# Altium project HU_revC.PrjPcb (part 4 of 4)

## Sheet PWR_SW_AND_VI_SENSE.SchDoc
size B; SheetNumber: 16; SheetTotal: 21
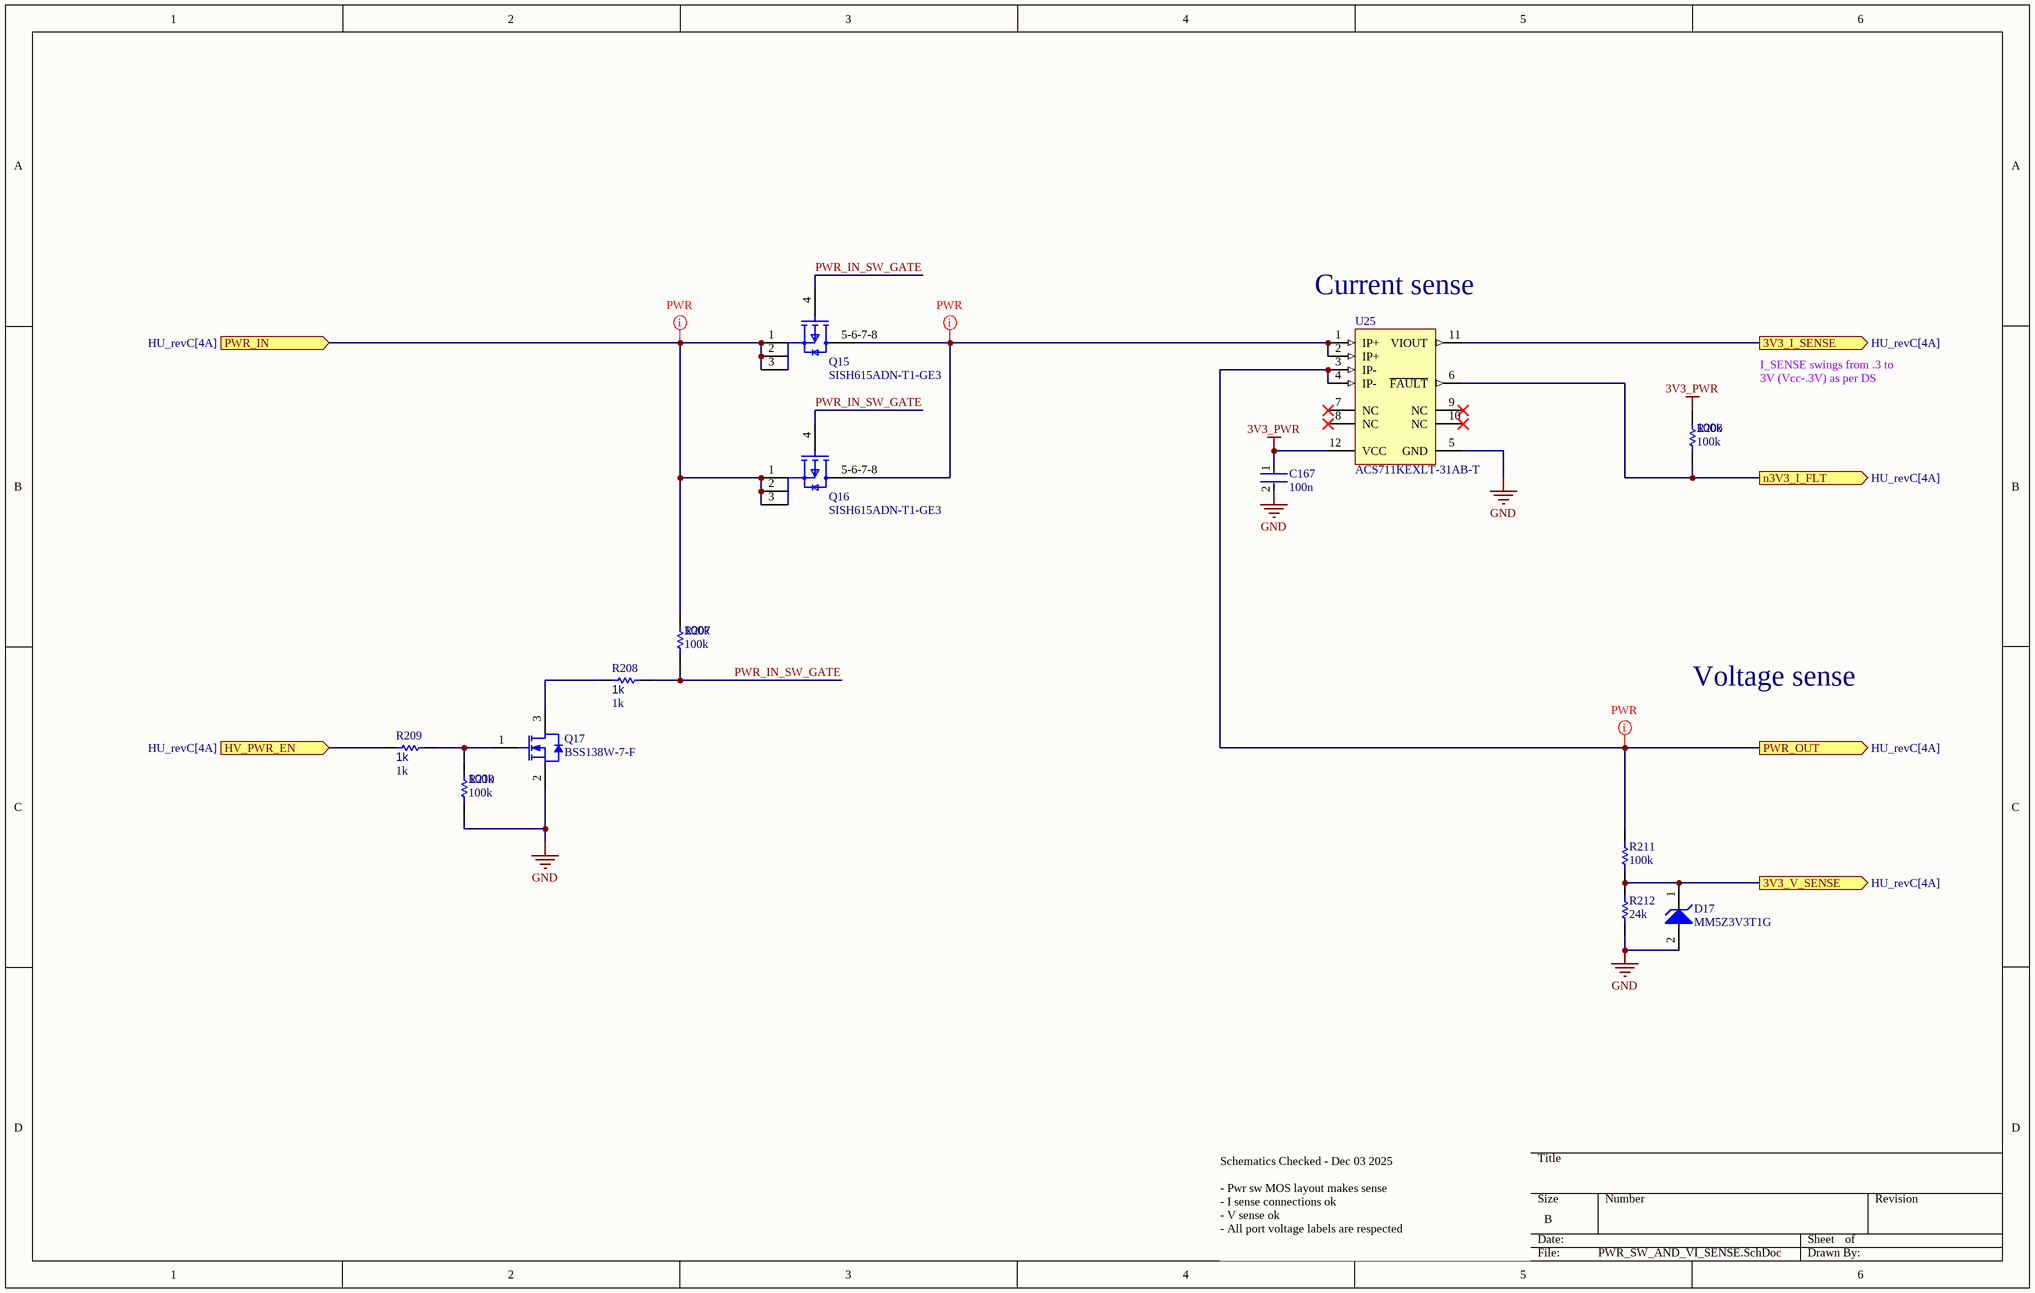
[diagram p24: PWR_SW_AND_VI_SENSE.SchDoc]

### Parts
C167  100n  [FP-0402-L_1_0_0_05-W_0_5-IPC_A]
D17  MM5Z3V3T1G  [ONSC-SOD-523-2-502-01_V]
Q15  SISH615ADN-T1-GE3  [SISH615ADN-T1-GE3-Footprint-1]
Q16  SISH615ADN-T1-GE3  [SISH615ADN-T1-GE3-Footprint-1]
Q17  BSS138W-7-F  [DIOD-SOT323-3_V]
R206  100k  [R0603B]
R207  100k  [R0603B]
R208  1k  [R0603B]
R209  1k  [R0603B]
R210  100k  [R0603B]
R211  100k  [R0603B]
R212  24k  [R0603B]
U25  ACS711KEXLT-31AB-T  [ALEG-EX-12_V]

### Ports
3V3_I_SENSE (out, see HU_revC[4A]), 3V3_V_SENSE (out, see HU_revC[4A]), HV_PWR_EN (in, see HU_revC[4A]), n3V3_I_FLT (out, see HU_revC[4A]), PWR_IN (in, see HU_revC[4A]), PWR_OUT (out, see HU_revC[4A])

### Nets
3V3_PWR: C167.1 R206.2 U25.12(VCC)
GND: C167.2 D17.2(A) Q17.2(S) R210.1 R212.1 U25.5(GND)
INT_VCC: R211.2 U25.3(IP-) U25.4(IP-) ; port PWR_OUT
PRE_VCC: Q15.1(S) Q15.2(S) Q15.3(S) Q16.1(S) Q16.2(S) Q16.3(S) R207.2 ; port PWR_IN
3V3_INPUT_I_SENSE: U25.11(VIOUT) ; port 3V3_I_SENSE
3V3_INPUT_V_SENSE: D17.1(K) R211.1 R212.2 ; port 3V3_V_SENSE
3V3_PWR_nFLT: R206.1 U25.6(~{FAULT}) ; port n3V3_I_FLT
HV_PWR_EN: R209.1 ; port HV_PWR_EN
PWR_IN_SW_GATE: Q15.4(G) Q16.4(G) R207.1 R208.2
NetQ15_5-6-7-8: Q15.5-6-7-8(D) Q16.5-6-7-8(D) U25.1(IP+) U25.2(IP+)
NetQ17_1: Q17.1(G) R209.2 R210.2
NetQ17_3: Q17.3(D) R208.1

Not connected (* = marked no-connect by the designer): U25 7(NC)* 8(NC)* 9(NC)* 10(NC)*

### Layout directives
net class PWR: INT_VCC, NetQ15_5-6-7-8, PRE_VCC

### Notes on the sheet
- (near U25) Current sense
- I_SENSE swings from .3 to 3V (Vcc-.3V) as per DS
- Voltage sense
- Schematics Checked - Dec 03 2025
  - Pwr sw MOS layout makes sense
  - I sense connections ok
  - V sense ok
  - All port voltage labels are respected

### Library data of the parts
C167 = CMP-001-00058-1: as C65 on sheet MAX96724_PINOUT; Min Operating Temperature: -55°C; Mounting Technology: Surface Mount; Pins: 2; Case/Package: 0402; RoHS Compliant: Yes; Max Operating Temperature: 85°C
D17 = CMP-1060-00750-1: Zener Voltage Regulator, 500 mW, 2-Pin SOD-523, Pb-Free, Tape and Reel; Manufacturer: On Semiconductor; P Max (W): 0.5; VZ Typ (V): 3.3; RoHS: Pb-Free; ComponentLink2Description: Datasheet; PackageReference: SOD-523-2-502-01; DatasheetVersion: Rev. 10; ComponentLink1Description: Manufacturer URL; PackageVersion: Rev. E, 09/2010; ComponentLink3URL: http://www.onsemi.com/pub_link/Collateral/502-01.PDF; ComponentLink2URL: http://www.onsemi.cn/pub_link/Collateral/MM5Z2V4T1-D.PDF; Mounting Technology: Surface Mount; PartNumber: MM5Z3V3T1G; Packing: Tape and Reel; PackageDescription: 2-Pin SOD, Body 1.2 x 0.8 mm; ComponentLink1URL: http://www.onsemi.com/; ComponentLink3Description: Package Specification
Q15 Q16 = CMP-013-00018-2: Trans MOSFET P-CH 20V 22.1A 8-Pin PowerPAK 1212 EP T/R; Source: SISH615ADN-T1-GE3.SchLib; Design Item ID: CMP-013-00036-4; Component Type: Standard; Pins: 5
Q17 = CMP-2000-05968-1: N-Channel Enhancement Mode Mosfet, 50 V, 200 mA, -55 to 150 degC, 6-Pin SOT-323, RoHS, Tape and Reel; Typical Turn-Off Delay Time: 20ns; Number of Channels: 1Channel; Type: EnhancementModeFieldEffectTransistor; Brand: DiodesIncorporated; Vds - Drain-Source Breakdown Voltage: 75V; Vgs - Gate-Source Voltage: 20V; Rds On - Drain-Source Resistance: 1.4Ohms; Transistor Type: 1N-Channel; Configuration: Single; Unit Weight: 0.000212oz; Pd - Power Dissipation: 200mW; Id - Continuous Drain Current: 200mA; Forward Transconductance - Min: 0.1S; Manufacturer URL: http://www.diodes.com/; Series: BSS138; Package Description: 3-Pin Small Outline Transistor, Body 2 x 1.25 mm, Pitch 0.65 mm; Mounting Technology: SurfaceMount; Product Category: MOSFET; RoHS: True; Maximum Operating Temperature: +150C; Height: 1mm; Length: 2.2mm; Technology: Si; Width: 1.35mm; Datasheet URL: http://www.diodes.com/_files/datasheets/ds30206.pdf; Manufacturer: DiodesIncorporated; Package / Case: SOT-323-3; Typical Turn-On Delay Time: 20ns; Transistor Polarity: N-Channel; Factory Pack Quantity: 3000; Packaging: Reel; Product: MOSFETSmallSignal; Datasheet Version: Rev. 11-2, 09/2013; Package Reference: SOT323; Minimum Operating Temperature: -55C; Mounting Style: SMD/SMT; Channel Mode: Enhancement
R206-R212 = CMP-009-00002-14: Resistor
  R206 R207 R210 R211: Value: 100k
  R208 R209: Value: 1k
  R212: Value: 24k
U25 = CMP-1557-00002-1: Hall Effect Linear Current Sensor with Overcurrent Fault Output for <100 V Isolation Applications, 3 to 5.5 V, -31 to 31 A IP, -40 to 125 degC, 12-Pin QFN (EX), RoHS, Tape and Reel; IP Max: 31 A; VCC Min: 3 V; -3dB Bandwidth: 0.1 MHz; VCC Max: 5.5 V; IP Min: -31 A; Mounting Technology: Surface Mount; DatasheetVersion: Rev. 3; Temperature Min: -40 degC; ComponentLink1Description: Manufacturer URL; Packing: Tape and Reel; PartNumber: ACS711KEXLT-31AB-T; Temperature Max: 125 degC; ComponentLink2Description: Datasheet; ComponentLink3Description: Package Specification; RoHS: TRUE; ComponentLink1URL: http://www.allegromicro.com/; ComponentLink2URL: http://www.allegromicro.com/~/media/Files/Datasheets/ACS711-Datasheet.ashx?la=en; PackageDescription: 12-Pin Quad Flat No-Lead, Body 3 x 3 mm, Height 0.8 mm; ComponentLink3URL: http://www.allegromicro.com/~/media/Files/Datasheets/ACS711-Datasheet.ashx?la=en

## Sheet FUSE_AND_I_SENSE.SchDoc
size A; SheetNumber: 17; SheetTotal: 21
Used 3 times, as channels PWR_PROT_0, PWR_PROT_1, PWR_PROT_2. Parts and nets are listed once, with the designators drawn on the sheet.
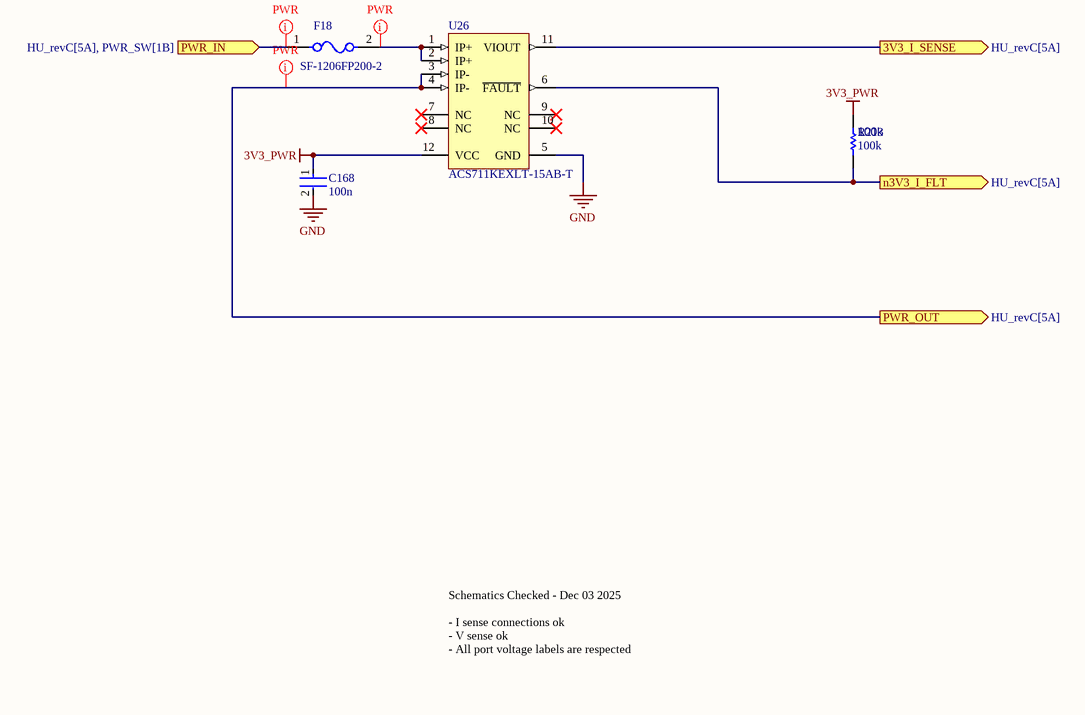
[diagram p25: FUSE_AND_I_SENSE.SchDoc]

### Parts
C168  100n  [FP-0402-L_1_0_0_05-W_0_5-IPC_A]
F18  SF-1206FP200-2  [FP-SF-1206FP-MFG]
R213  100k  [R0603B]
U26  ACS711KEXLT-15AB-T  [ALEG-EX-12_V]

### Ports
3V3_I_SENSE (out, see HU_revC[5A]), n3V3_I_FLT (out, see HU_revC[5A]), PWR_IN (in, see HU_revC[5A], PWR_SW[1B]), PWR_OUT (out, see HU_revC[5A])

### Nets
3V3_PWR: C168.1 R213.2 U26.12(VCC)
GND: C168.2 U26.5(GND)
3V3_I_SENSE: U26.11(VIOUT) ; port 3V3_I_SENSE
n3V3_I_FLT: R213.1 U26.6(~{FAULT}) ; port n3V3_I_FLT
PWR_IN: F18.1 ; port PWR_IN
PWR_OUT: U26.3(IP-) U26.4(IP-) ; port PWR_OUT
NetF18_2: F18.2 U26.1(IP+) U26.2(IP+)

Not connected (* = marked no-connect by the designer): U26 7(NC)* 8(NC)* 9(NC)* 10(NC)*

### Channels
PWR_PROT_0: designators end in _PWR_PROT_0; ports 3V3_I_SENSE=3V3_12V_VCC_I_SENSE n3V3_I_FLT=3V3_PWR_nFLT PWR_IN=INT_VCC PWR_OUT=12V0_PoC
PWR_PROT_1: designators end in _PWR_PROT_1; ports 3V3_I_SENSE=3V3_5V0_VCC_I_SENSE n3V3_I_FLT=3V3_PWR_nFLT PWR_IN=INT_VCC PWR_OUT=NetC27_1
PWR_PROT_2: designators end in _PWR_PROT_2; ports 3V3_I_SENSE=3V3_3V3_VCC_I_SENSE n3V3_I_FLT=3V3_PWR_nFLT PWR_IN=INT_VCC PWR_OUT=NetC57_1

### Layout directives
net class PWR: 12V0_PoC, INT_VCC, NetF18_PWR_PROT_0_2

### Notes on the sheet
- Schematics Checked - Dec 03 2025
  - I sense connections ok
  - V sense ok
  - All port voltage labels are respected

### Library data of the parts
C168 = CMP-001-00058-1: as C65 on sheet MAX96724_PINOUT; Min Operating Temperature: -55°C; Mounting Technology: Surface Mount; Pins: 2; Case/Package: 0402; RoHS Compliant: Yes; Max Operating Temperature: 85°C
F18 = CMP-07399-000013-1: FUSE BOARD MOUNT 2A 63VDC 1206; Voltage Rating (DC): 63V; Fuse Type: Board Mount (Cartridge Style Excluded); Approvals: UL; Mount: Surface Mount; Min Operating Temperature: -20°C; Max Operating Temperature: 105°C; Case Code (Imperial): 1206; Packaging: Cut Tape; Current Rating: 2A; RoHS Compliant: Yes; Series: SinglFuse™ SF-1206FP; Case Code (Metric): 3216; Case/Package: 1206
R213 = CMP-009-00002-14: Resistor; Value: 100k
U26 = CMP-1557-00001-1: Hall Effect Linear Current Sensor with Overcurrent Fault Output for <100 V Isolation Applications, 3 to 5.5 V, -15.5 to 15.5 A IP, -40 to 125 degC, 12-Pin QFN (EX), RoHS, Tape and Reel; VCC Max: 5.5 V; IP Max: 15.5 A; VCC Min: 3 V; IP Min: -15.5 A; -3dB Bandwidth: 0.1 MHz; PackageDescription: 12-Pin Quad Flat No-Lead, Body 3 x 3 mm, Height 0.8 mm; ComponentLink1URL: http://www.allegromicro.com/; Packing: Tape and Reel; ComponentLink2URL: http://www.allegromicro.com/~/media/Files/Datasheets/ACS711-Datasheet.ashx?la=en; DatasheetVersion: Rev. 3; PartNumber: ACS711KEXLT-15AB-T; ComponentLink2Description: Datasheet; ComponentLink3URL: http://www.allegromicro.com/~/media/Files/Datasheets/ACS711-Datasheet.ashx?la=en; RoHS: TRUE; ComponentLink1Description: Manufacturer URL; ComponentLink3Description: Package Specification; Temperature Max: 125 degC; Mounting Technology: Surface Mount; Temperature Min: -40 degC

## Sheet LAN8830_PINOUT.SchDoc
size C; SheetNumber: 18; SheetTotal: 21
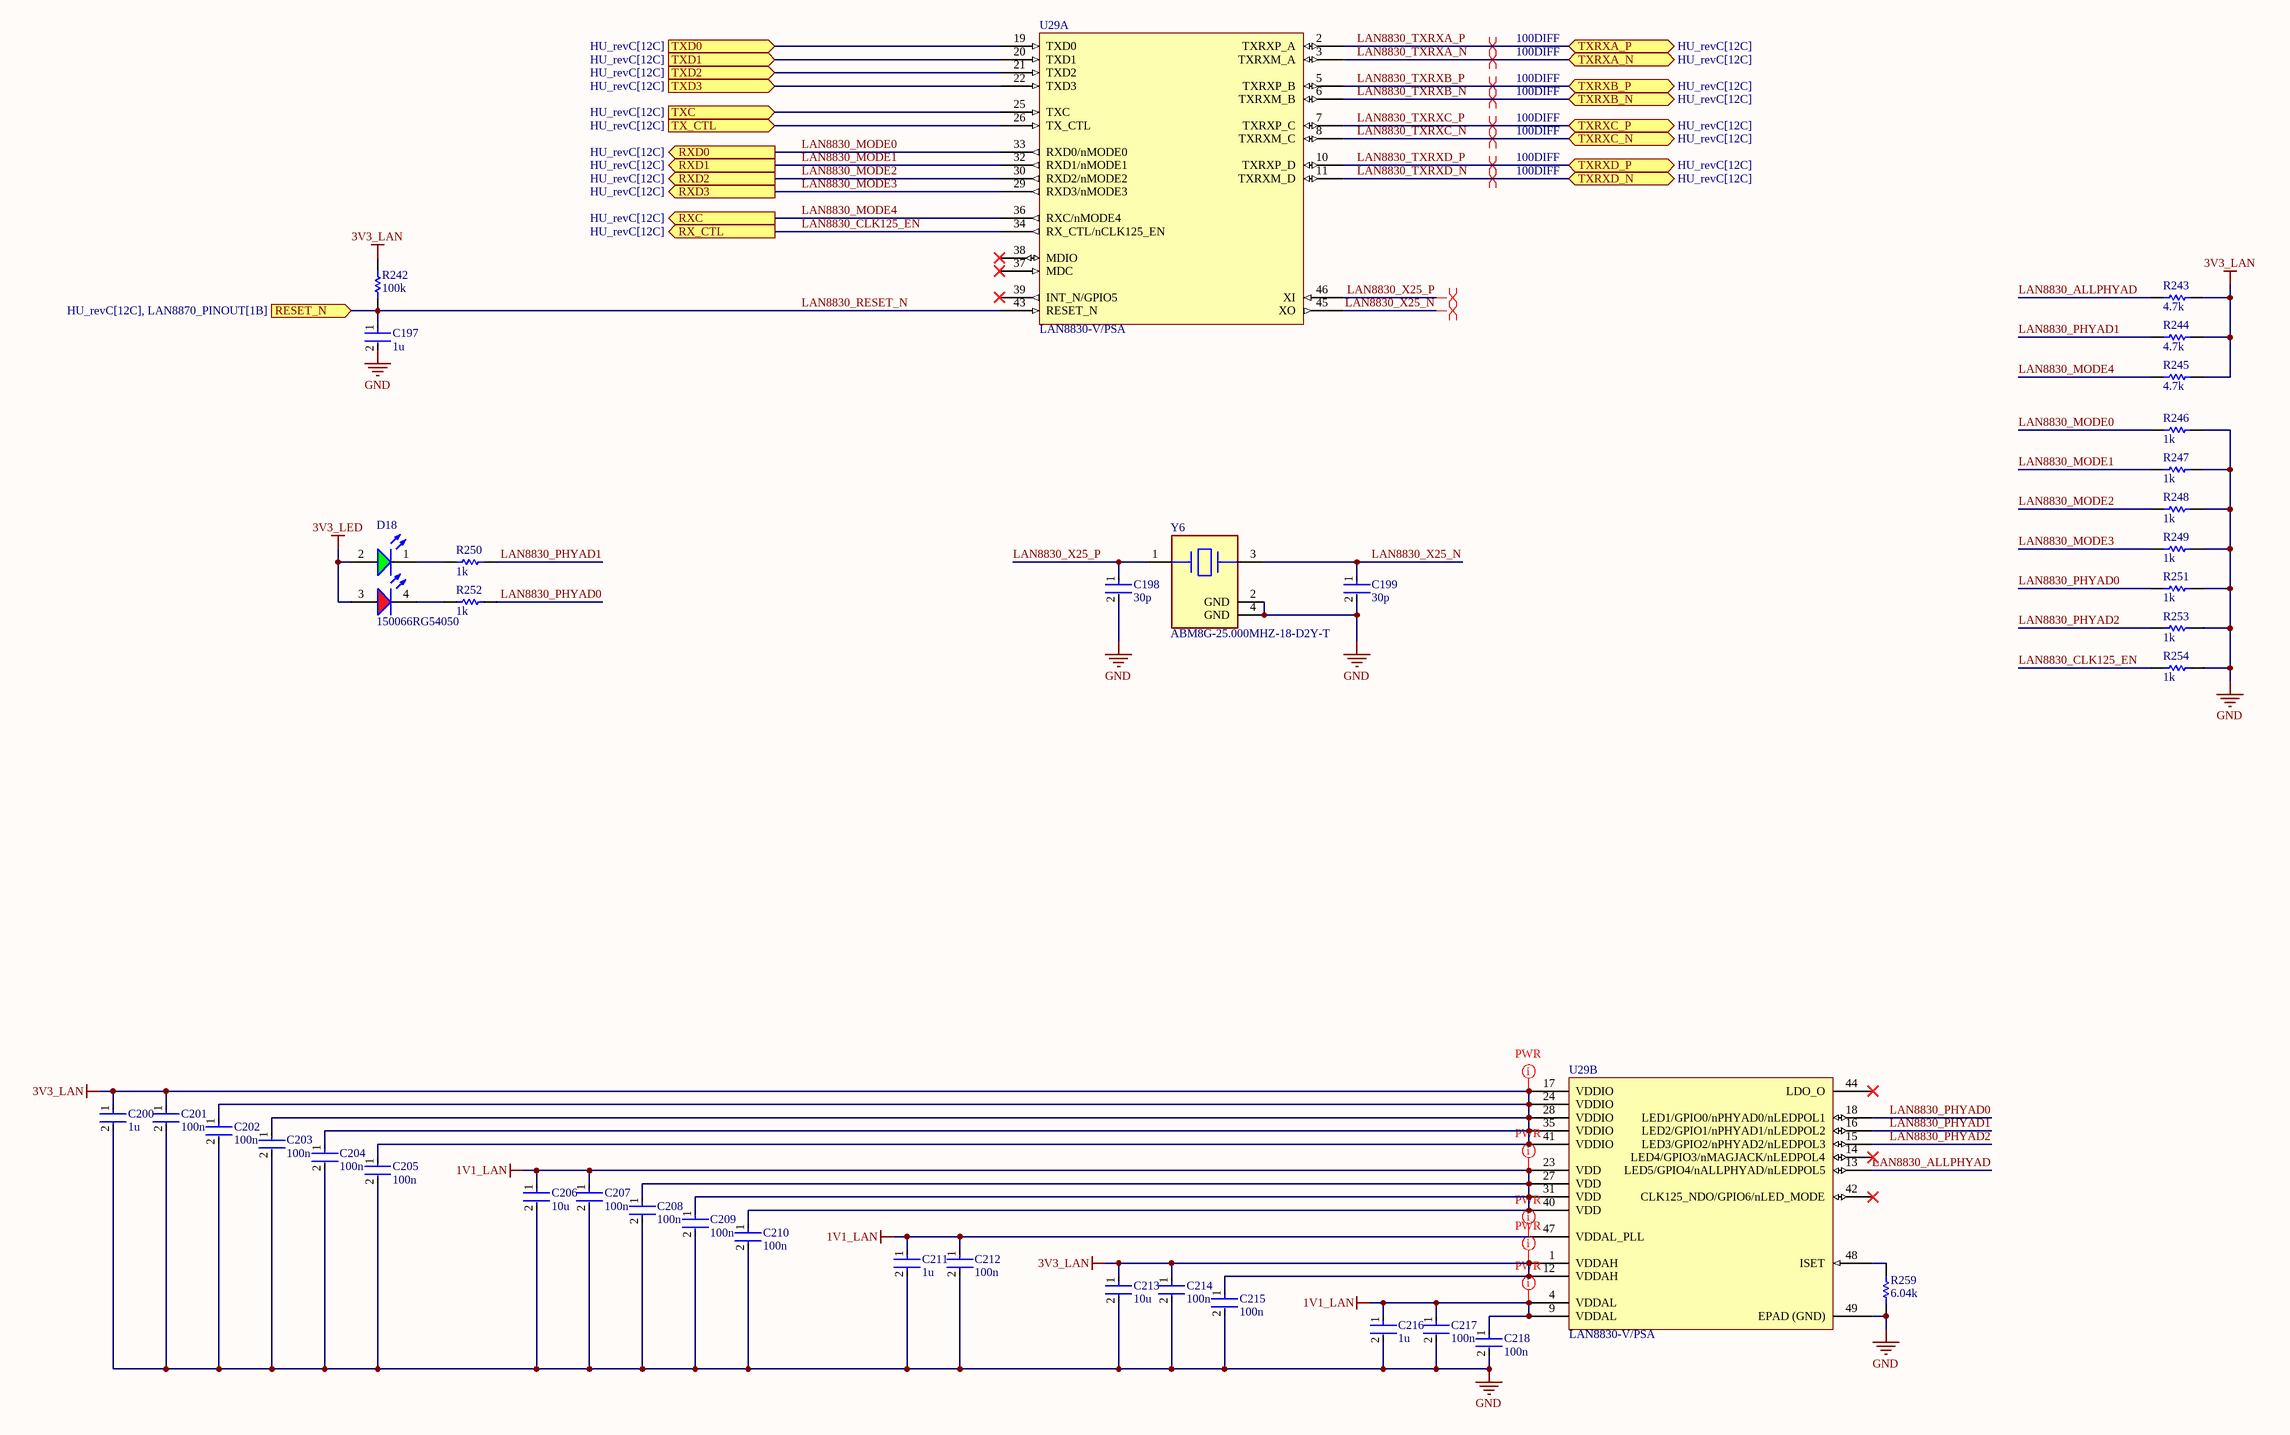
[diagram p26: LAN8830_PINOUT.SchDoc]

### Parts
C197  1u  [FP-0402-L_1_0_0_05-W_0_5-IPC_A]
C198  30p  [FP-0402-L_1_0_0_05-W_0_5-IPC_A]
C199  30p  [FP-0402-L_1_0_0_05-W_0_5-IPC_A]
C200  1u  [FP-0402-L_1_0_0_05-W_0_5-IPC_A]
C201  100n  [FP-0402-L_1_0_0_05-W_0_5-IPC_A]
C202  100n  [FP-0402-L_1_0_0_05-W_0_5-IPC_A]
C203  100n  [FP-0402-L_1_0_0_05-W_0_5-IPC_A]
C204  100n  [FP-0402-L_1_0_0_05-W_0_5-IPC_A]
C205  100n  [FP-0402-L_1_0_0_05-W_0_5-IPC_A]
C206  10u  [FP-0402-L_1_0_0_05-W_0_5-IPC_A]
C207  100n  [FP-0402-L_1_0_0_05-W_0_5-IPC_A]
C208  100n  [FP-0402-L_1_0_0_05-W_0_5-IPC_A]
C209  100n  [FP-0402-L_1_0_0_05-W_0_5-IPC_A]
C210  100n  [FP-0402-L_1_0_0_05-W_0_5-IPC_A]
C211  1u  [FP-0402-L_1_0_0_05-W_0_5-IPC_A]
C212  100n  [FP-0402-L_1_0_0_05-W_0_5-IPC_A]
C213  10u  [FP-0402-L_1_0_0_05-W_0_5-IPC_A]
C214  100n  [FP-0402-L_1_0_0_05-W_0_5-IPC_A]
C215  100n  [FP-0402-L_1_0_0_05-W_0_5-IPC_A]
C216  1u  [FP-0402-L_1_0_0_05-W_0_5-IPC_A]
C217  100n  [FP-0402-L_1_0_0_05-W_0_5-IPC_A]
C218  100n  [FP-0402-L_1_0_0_05-W_0_5-IPC_A]
D18  150066RG54050  [WL-SBCD_0606]
R242  100k  [R0603B]
R243  4.7k  [R0603B]
R244  4.7k  [R0603B]
R245  4.7k  [R0603B]
R246  1k  [R0603B]
R247  1k  [R0603B]
R248  1k  [R0603B]
R249  1k  [R0603B]
R250  1k  [R0603B]
R251  1k  [R0603B]
R252  1k  [R0603B]
R253  1k  [R0603B]
R254  1k  [R0603B]
R259  6.04k  [R0603B]
U29  LAN8830-V/PSA  [QFN50P700X700X100_HS-49N]  (parts A,B of 2)
Y6  ABM8G-25.000MHZ-18-D2Y-T  [FP-ABM8G-MFG]

### Ports
RESET_N (in, see HU_revC[12C], LAN8870_PINOUT[1B]), RX_CTL (out, see HU_revC[12C]), RXC (out, see HU_revC[12C]), RXD0 (out, see HU_revC[12C]), RXD1 (out, see HU_revC[12C]), RXD2 (out, see HU_revC[12C]), RXD3 (out, see HU_revC[12C]), TX_CTL (in, see HU_revC[12C]), TXC (in, see HU_revC[12C]), TXD0 (in, see HU_revC[12C]), TXD1 (in, see HU_revC[12C]), TXD2 (in, see HU_revC[12C]), TXD3 (in, see HU_revC[12C]), TXRXA_N (bidir, see HU_revC[12C]), TXRXA_P (bidir, see HU_revC[12C]), TXRXB_N (bidir, see HU_revC[12C]), TXRXB_P (bidir, see HU_revC[12C]), TXRXC_N (bidir, see HU_revC[12C]), TXRXC_P (bidir, see HU_revC[12C]), TXRXD_N (bidir, see HU_revC[12C]), TXRXD_P (bidir, see HU_revC[12C])

### Nets
1V1_LAN: C206.1 C207.1 C208.1 C209.1 C210.1 C211.1 C212.1 C216.1 C217.1 C218.1 U29.4(VDDAL) U29.9(VDDAL) U29.23(VDD) U29.27(VDD) U29.31(VDD) U29.40(VDD) U29.47(VDDAL_PLL)
3V3_LAN: C200.1 C201.1 C202.1 C203.1 C204.1 C205.1 C213.1 C214.1 C215.1 R242.1 R243.1 R244.1 R245.1 U29.1(VDDAH) U29.12(VDDAH) U29.17(VDDIO) U29.24(VDDIO) U29.28(VDDIO) U29.35(VDDIO) U29.41(VDDIO)
3V3_LED: D18.2(A) D18.3(A)
GND: C197.2 C198.2 C199.2 C200.2 C201.2 C202.2 C203.2 C204.2 C205.2 C206.2 C207.2 C208.2 C209.2 C210.2 C211.2 C212.2 C213.2 C214.2 C215.2 C216.2 C217.2 C218.2 R246.1 R247.1 R248.1 R249.1 R251.1 R253.1 R254.1 R259.2 U29.49(EPAD_(GND)) Y6.2(GND) Y6.4(GND)
LAN8830_ALLPHYAD: R243.2 U29.13(LED5/GPIO4/nALLPHYAD/nLEDPOL5)
LAN8830_CLK125_EN: R254.2 U29.34(RX_CTL/nCLK125_EN) ; port RX_CTL
LAN8830_MODE0: R246.2 U29.33(RXD0/nMODE0) ; port RXD0
LAN8830_MODE1: R247.2 U29.32(RXD1/nMODE1) ; port RXD1
LAN8830_MODE2: R248.2 U29.30(RXD2/nMODE2) ; port RXD2
LAN8830_MODE3: R249.2 U29.29(RXD3/nMODE3) ; port RXD3
LAN8830_MODE4: R245.2 U29.36(RXC/nMODE4) ; port RXC
LAN8830_PHYAD0: R251.2 R252.2 U29.18(LED1/GPIO0/nPHYAD0/nLEDPOL1)
LAN8830_PHYAD1: R244.2 R250.2 U29.16(LED2/GPIO1/nPHYAD1/nLEDPOL2)
LAN8830_PHYAD2: R253.2 U29.15(LED3/GPIO2/nPHYAD2/nLEDPOL3)
LAN8830_RESET_N: C197.1 R242.2 U29.43(RESET_N) ; port RESET_N
LAN8830_TXRXA_N: U29.3(TXRXM_A) ; port TXRXA_N  [project net ETH_TRD0_N]
LAN8830_TXRXA_P: U29.2(TXRXP_A) ; port TXRXA_P  [project net ETH_TRD0_P]
LAN8830_TXRXB_N: U29.6(TXRXM_B) ; port TXRXB_N  [project net ETH_TRD1_N]
LAN8830_TXRXB_P: U29.5(TXRXP_B) ; port TXRXB_P  [project net ETH_TRD1_P]
LAN8830_TXRXC_N: U29.8(TXRXM_C) ; port TXRXC_N  [project net ETH_TRD2_N]
LAN8830_TXRXC_P: U29.7(TXRXP_C) ; port TXRXC_P  [project net ETH_TRD2_P]
LAN8830_TXRXD_N: U29.11(TXRXM_D) ; port TXRXD_N  [project net ETH_TRD3_N]
LAN8830_TXRXD_P: U29.10(TXRXP_D) ; port TXRXD_P  [project net ETH_TRD3_P]
LAN8830_X25_N: C199.1 U29.45(XO) Y6.3
LAN8830_X25_P: C198.1 U29.46(XI) Y6.1
NetD18_1: D18.1(K) R250.1
NetD18_4: D18.4(K) R252.1
NetR52_2: U29.19(TXD0) ; port TXD0
NetR53_2: U29.20(TXD1) ; port TXD1
NetR54_2: U29.21(TXD2) ; port TXD2
NetR55_2: U29.22(TXD3) ; port TXD3
NetR259_1: R259.1 U29.48(ISET)
NetR269_2: U29.25(TXC) ; port TXC
NetR270_2: U29.26(TX_CTL) ; port TX_CTL

Not connected (* = marked no-connect by the designer): U29 14(LED4/GPIO3/nMAGJACK/nLEDPOL4)* 37(MDC)* 38(MDIO)* 39(INT_N/GPIO5)* 42(CLK125_NDO/GPIO6/nLED_MODE)* 44(LDO_O)*

### Layout directives
differential pair; differential pair class 100DIFF: ETH_TRD0_N, ETH_TRD0_P, ETH_TRD1_N, ETH_TRD1_P, ETH_TRD2_N, ETH_TRD2_P, ETH_TRD3_N, ETH_TRD3_P
differential pair: LAN8830_X25_N, LAN8830_X25_P
net class PWR: 1V1_LAN, 3V3_LAN

### Library data of the parts
C197-C218 = CMP-001-00058-1: as C65 on sheet MAX96724_PINOUT; Min Operating Temperature: -55°C; Mounting Technology: Surface Mount; Pins: 2; Case/Package: 0402; RoHS Compliant: Yes; Max Operating Temperature: 85°C
D18 = CMP-004-00040-2: Led, Red/Grn, 180Mcd/230Mcd, 624Nm/525Nm Rohs Compliant: Yes; Source: rgled.SchLib; Component Type: Standard; Design Item ID: CMP-004-00034-2; Pins: 4
R242-R254 R259 = CMP-009-00002-14: Resistor
  R242: Value: 100k
  R243-R245: Value: 4.7k
  R246-R254: Value: 1k
  R259: Value: 6.04k
U29 = CMP-015-00022-5: LAN8830 Series RGMII Interface Gigabit Ethernet Transceiver - VQFN-48; Case/Package: VQFN; Pins: 48
Y6 = CMP-2000-05733-3: Crystal 25MHz ±20ppm (Tol) ±30ppm (Stability) 18pF FUND 60Ω 4-Pin SMD T/R; Series Resistance: 60R; Length: 3.2mm; Depth: 2.5mm; Packaging: Tape and Reel; Min Operating Temperature: -40°C; Operating Frequency: 25 MHz; Lead Free: Lead Free; Number of Pins: 4; Frequency Tolerance: 20ppm; Radiation Hardening: No; Max Operating Temperature: 85°C; Termination: SMD/SMT; Frequency Stability: 30ppm; Frequency: 25MHz; Series: ABM8G; Mount: Surface Mount; Package Quantity: 1000; Height: 0.039inch; Width: 0.098inch; Case/Package: CSMD; ESR (Equivalent Series Resistance): 60R; Load Capacitance: 18pF; Tolerance: 20ppm

## Sheet LAN8870_PINOUT.SchDoc
size C; SheetNumber: 19; SheetTotal: 20
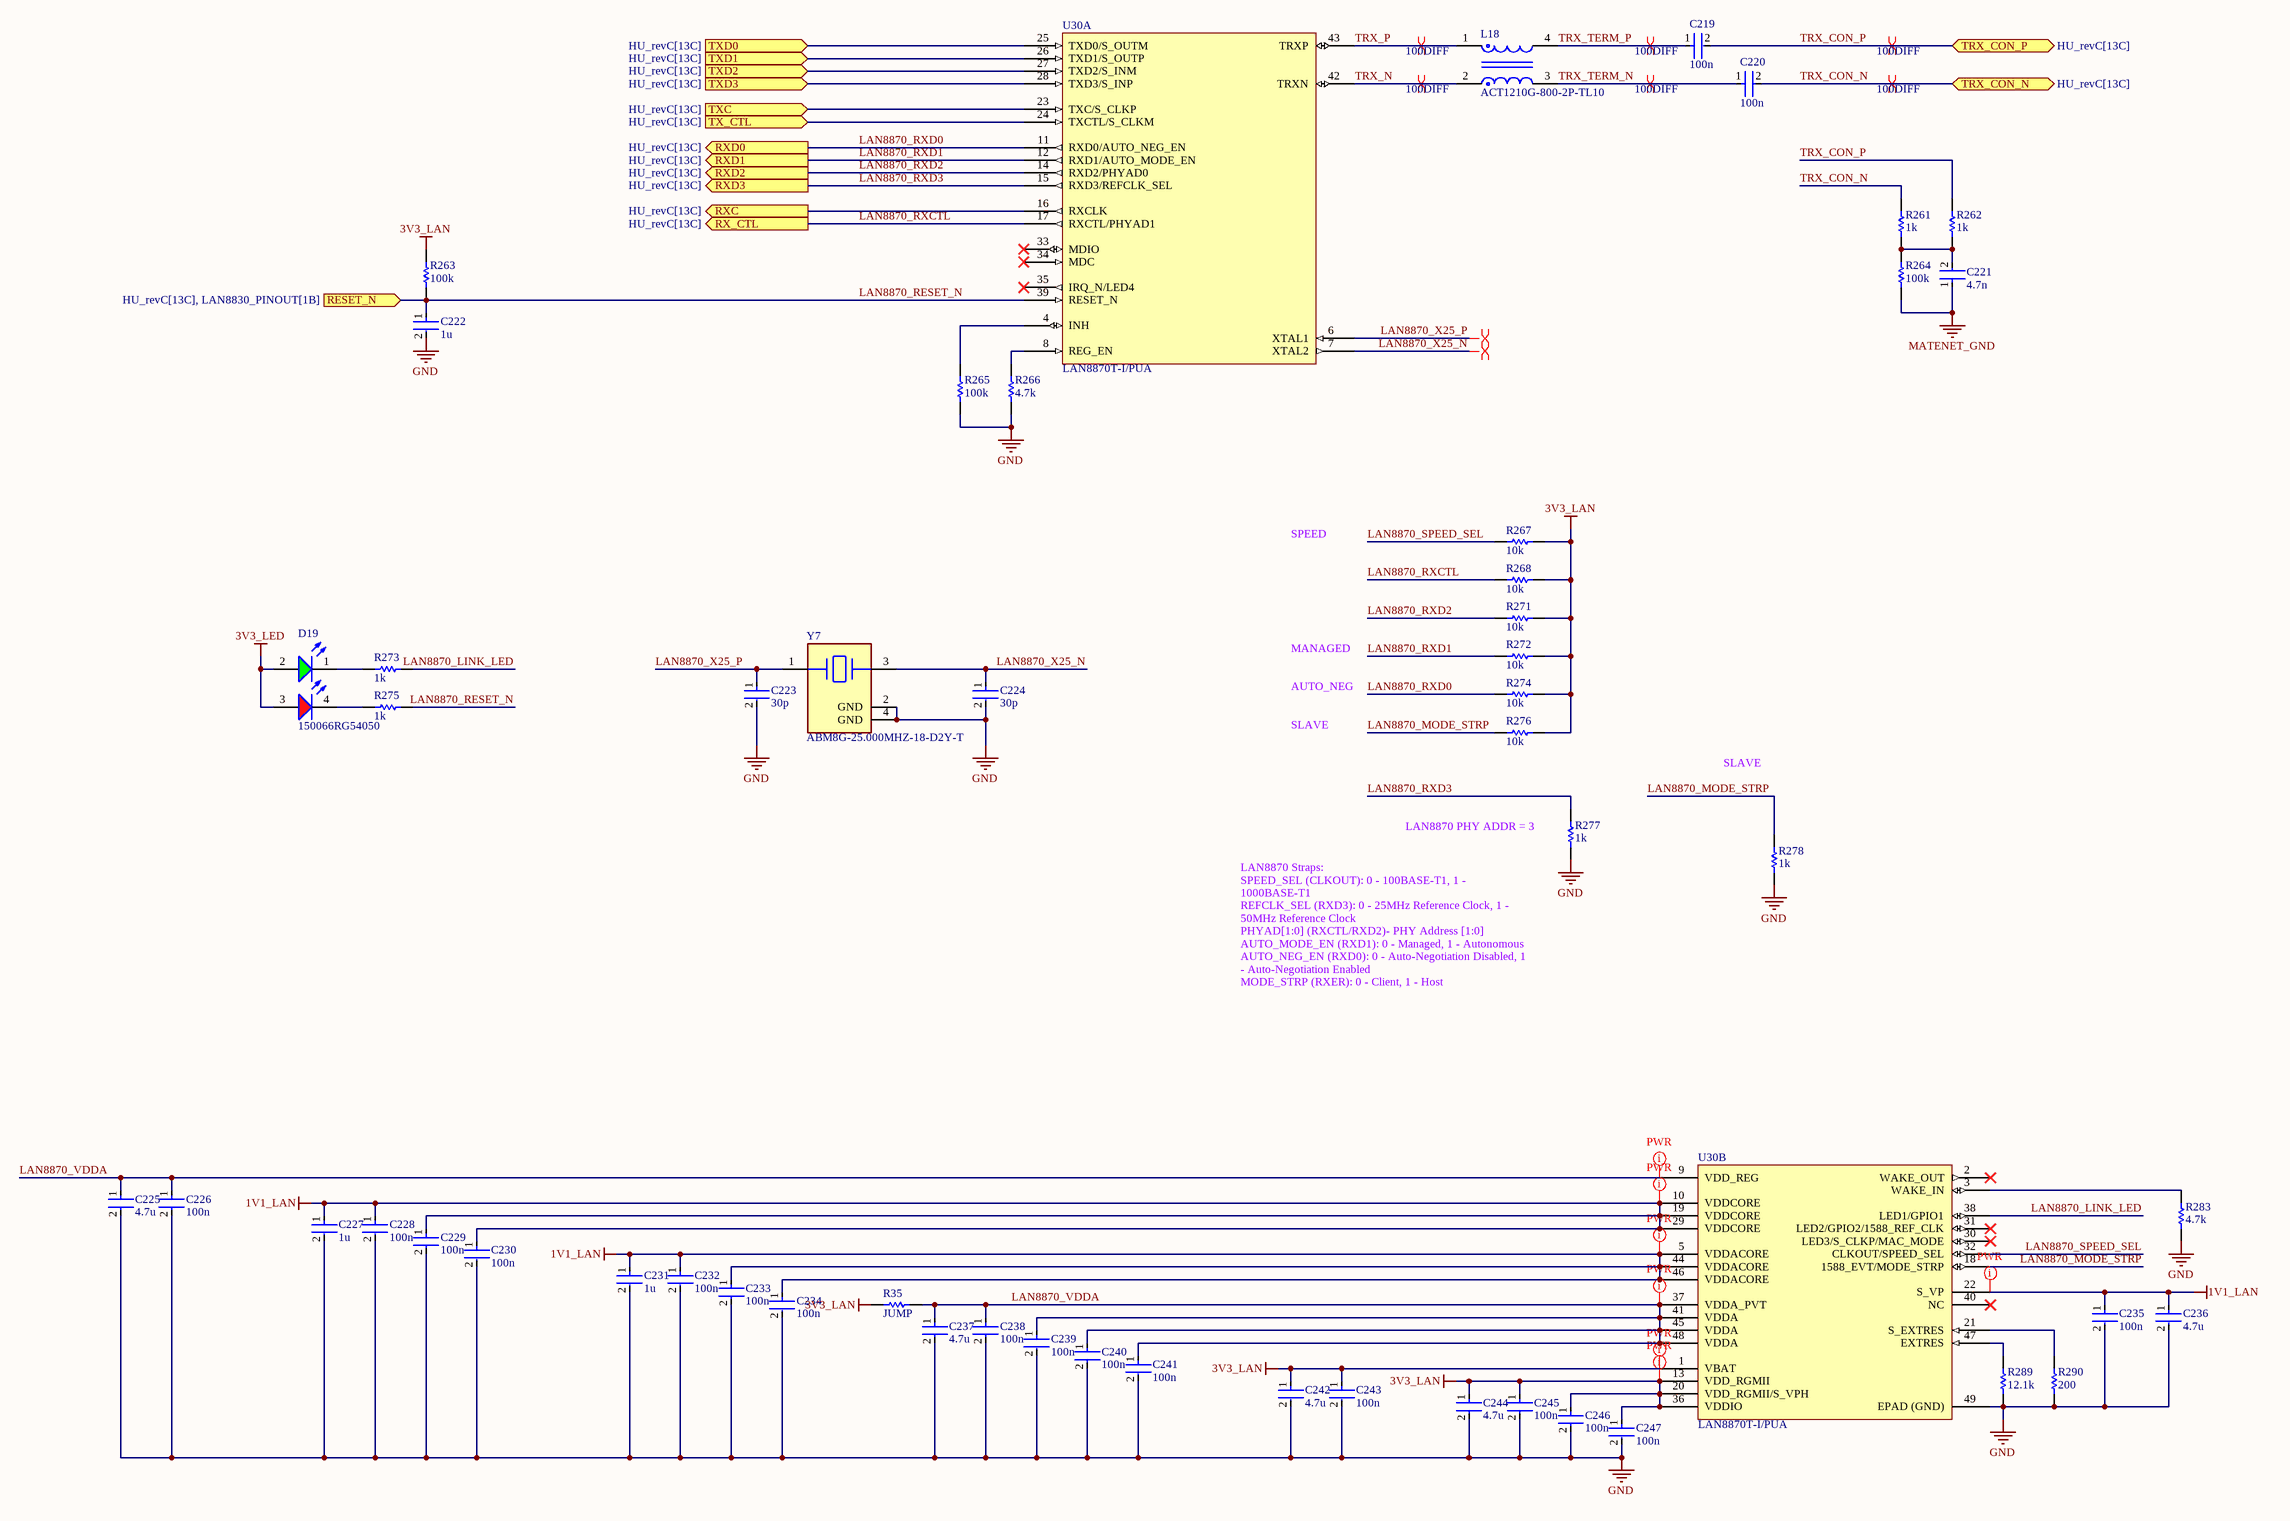
[diagram p27: LAN8870_PINOUT.SchDoc]

### Parts
C219  100n  [FP-0402-L_1_0_0_05-W_0_5-IPC_A]
C220  100n  [FP-0402-L_1_0_0_05-W_0_5-IPC_A]
C221  4.7n  [FP-0402-L_1_0_0_05-W_0_5-IPC_A]
C222  1u  [FP-0402-L_1_0_0_05-W_0_5-IPC_A]
C223  30p  [FP-0402-L_1_0_0_05-W_0_5-IPC_A]
C224  30p  [FP-0402-L_1_0_0_05-W_0_5-IPC_A]
C225  4.7u  [FP-0402-L_1_0_0_05-W_0_5-IPC_A]
C226  100n  [FP-0402-L_1_0_0_05-W_0_5-IPC_A]
C227  1u  [FP-0402-L_1_0_0_05-W_0_5-IPC_A]
C228  100n  [FP-0402-L_1_0_0_05-W_0_5-IPC_A]
C229  100n  [FP-0402-L_1_0_0_05-W_0_5-IPC_A]
C230  100n  [FP-0402-L_1_0_0_05-W_0_5-IPC_A]
C231  1u  [FP-0402-L_1_0_0_05-W_0_5-IPC_A]
C232  100n  [FP-0402-L_1_0_0_05-W_0_5-IPC_A]
C233  100n  [FP-0402-L_1_0_0_05-W_0_5-IPC_A]
C234  100n  [FP-0402-L_1_0_0_05-W_0_5-IPC_A]
C235  100n  [FP-0402-L_1_0_0_05-W_0_5-IPC_A]
C236  4.7u  [FP-0402-L_1_0_0_05-W_0_5-IPC_A]
C237  4.7u  [FP-0402-L_1_0_0_05-W_0_5-IPC_A]
C238  100n  [FP-0402-L_1_0_0_05-W_0_5-IPC_A]
C239  100n  [FP-0402-L_1_0_0_05-W_0_5-IPC_A]
C240  100n  [FP-0402-L_1_0_0_05-W_0_5-IPC_A]
C241  100n  [FP-0402-L_1_0_0_05-W_0_5-IPC_A]
C242  4.7u  [FP-0402-L_1_0_0_05-W_0_5-IPC_A]
C243  100n  [FP-0402-L_1_0_0_05-W_0_5-IPC_A]
C244  4.7u  [FP-0402-L_1_0_0_05-W_0_5-IPC_A]
C245  100n  [FP-0402-L_1_0_0_05-W_0_5-IPC_A]
C246  100n  [FP-0402-L_1_0_0_05-W_0_5-IPC_A]
C247  100n  [FP-0402-L_1_0_0_05-W_0_5-IPC_A]
D19  150066RG54050  [WL-SBCD_0606]
L18  ACT1210G-800-2P-TL10  [FP-ACT1210G-800-2P-TL10-MFG]
R35  JUMP  [R0603B]
R261  1k  [R0603B]
R262  1k  [R0603B]
R263  100k  [R0603B]
R264  100k  [R0603B]
R265  100k  [R0603B]
R266  4.7k  [R0603B]
R267  10k  [R0603B]
R268  10k  [R0603B]
R271  10k  [R0603B]
R272  10k  [R0603B]
R273  1k  [R0603B]
R274  10k  [R0603B]
R275  1k  [R0603B]
R276  10k  [R0603B]
R277  1k  [R0603B]
R278  1k  [R0603B]
R283  4.7k  [R0603B]
R289  12.1k  [R0603B]
R290  200  [R0603B]
U30  LAN8870T-I/PUA  [QFN50P700X700X100_HS-49N]  (parts A,B of 2)
Y7  ABM8G-25.000MHZ-18-D2Y-T  [FP-ABM8G-MFG]

### Ports
RESET_N (in, see HU_revC[13C], LAN8830_PINOUT[1B]), RX_CTL (out, see HU_revC[13C]), RXC (out, see HU_revC[13C]), RXD0 (out, see HU_revC[13C]), RXD1 (out, see HU_revC[13C]), RXD2 (out, see HU_revC[13C]), RXD3 (out, see HU_revC[13C]), TRX_CON_N (bidir, see HU_revC[13C]), TRX_CON_P (bidir, see HU_revC[13C]), TX_CTL (in, see HU_revC[13C]), TXC (in, see HU_revC[13C]), TXD0 (in, see HU_revC[13C]), TXD1 (in, see HU_revC[13C]), TXD2 (in, see HU_revC[13C]), TXD3 (in, see HU_revC[13C])

### Nets
1V1_LAN: C227.1 C228.1 C229.1 C230.1 C231.1 C232.1 C233.1 C234.1 C235.1 C236.1 U30.5(VDDACORE) U30.10(VDDCORE) U30.19(VDDCORE) U30.22(S_VP) U30.29(VDDCORE) U30.44(VDDACORE) U30.46(VDDACORE)
3V3_LAN: C242.1 C243.1 C244.1 C245.1 C246.1 C247.1 R35.1 R263.1 R267.2 R268.1 R271.2 R272.2 R274.2 R276.2 U30.1(VBAT) U30.13(VDD_RGMII) U30.20(VDD_RGMII/S_VPH) U30.36(VDDIO)
3V3_LED: D19.2(A) D19.3(A)
GND: C222.2 C223.2 C224.2 C225.2 C226.2 C227.2 C228.2 C229.2 C230.2 C231.2 C232.2 C233.2 C234.2 C235.2 C236.2 C237.2 C238.2 C239.2 C240.2 C241.2 C242.2 C243.2 C244.2 C245.2 C246.2 C247.2 R265.2 R266.2 R277.1 R278.1 R283.2 R289.2 R290.2 U30.49(EPAD_(GND)) Y7.2(GND) Y7.4(GND)
MATENET_GND: C221.1 R264.2
LAN8870_LINK_LED: R273.2 U30.38(LED1/GPIO1)
LAN8870_MODE_STRP: R276.1 R278.2 U30.18(1588_EVT/MODE_STRP)
LAN8870_RESET_N: C222.1 R263.2 R275.2 U30.39(RESET_N) ; port RESET_N  [project net LAN8830_RESET_N]
LAN8870_RXCTL: R268.2 U30.17(RXCTL/PHYAD1) ; port RX_CTL
LAN8870_RXD0: R274.1 U30.11(RXD0/AUTO_NEG_EN) ; port RXD0
LAN8870_RXD1: R272.1 U30.12(RXD1/AUTO_MODE_EN) ; port RXD1
LAN8870_RXD2: R271.1 U30.14(RXD2/PHYAD0) ; port RXD2
LAN8870_RXD3: R277.2 U30.15(RXD3/REFCLK_SEL) ; port RXD3
LAN8870_SPEED_SEL: R267.1 U30.32(CLKOUT/SPEED_SEL)
LAN8870_VDDA: C225.1 C226.1 C237.1 C238.1 C239.1 C240.1 C241.1 R35.2 U30.9(VDD_REG) U30.37(VDDA_PVT) U30.41(VDDA) U30.45(VDDA) U30.48(VDDA)
LAN8870_X25_N: C224.1 U30.7(XTAL2) Y7.3
LAN8870_X25_P: C223.1 U30.6(XTAL1) Y7.1
TRX_CON_N: C220.2 R261.2 ; port TRX_CON_N
TRX_CON_P: C219.2 R262.2 ; port TRX_CON_P
TRX_N: L18.2 U30.42(TRXN)
TRX_P: L18.1 U30.43(TRXP)
TRX_TERM_N: C220.1 L18.3
TRX_TERM_P: C219.1 L18.4
NetC221_2: C221.2 R261.1 R262.1 R264.1
NetD19_1: D19.1(K) R273.1
NetD19_4: D19.4(K) R275.1
NetR265_1: R265.1 U30.4(INH)
NetR266_1: R266.1 U30.8(REG_EN)
NetR269_1: U30.16(RXCLK) ; port RXC
NetR279_1: U30.25(TXD0/S_OUTM) ; port TXD0
NetR283_1: R283.1 U30.3(WAKE_IN)
NetR289_1: R289.1 U30.47(EXTRES)
NetR290_1: R290.1 U30.21(S_EXTRES)
NetR291_1: U30.26(TXD1/S_OUTP) ; port TXD1
NetR292_1: U30.27(TXD2/S_INM) ; port TXD2
NetR293_1: U30.28(TXD3/S_INP) ; port TXD3
NetR294_1: U30.23(TXC/S_CLKP) ; port TXC
NetR295_1: U30.24(TXCTL/S_CLKM) ; port TX_CTL

Not connected (* = marked no-connect by the designer): U30 2(WAKE_OUT)* 30(LED3/S_CLKP/MAC_MODE)* 31(LED2/GPIO2/1588_REF_CLK)* 33(MDIO)* 34(MDC)* 35(IRQ_N/LED4)* 40(NC)*

### Layout directives
differential pair; differential pair class 100DIFF: TRX_CON_N, TRX_CON_P, TRX_N, TRX_P, TRX_TERM_N, TRX_TERM_P
differential pair: LAN8870_X25_N, LAN8870_X25_P
net class PWR: 1V1_LAN, 3V3_LAN, LAN8870_VDDA

### Notes on the sheet
- SPEED
- AUTO_NEG
- MANAGED
- SLAVE
- LAN8870 PHY ADDR = 3
- (near R277) LAN8870 Straps:
  SPEED_SEL (CLKOUT): 0 - 100BASE-T1, 1 - 1000BASE-T1
  REFCLK_SEL (RXD3): 0 - 25MHz Reference Clock, 1 - 50MHz Reference Clock
  PHYAD[1:0] (RXCTL/RXD2)- PHY Address [1:0]
  AUTO_MODE_EN (RXD1): 0 - Managed, 1 - Autonomous
  AUTO_NEG_EN (RXD0): 0 - Auto-Negotiation Disabled, 1 - Auto-Negotiation Enabled
  MODE_STRP (RXER): 0 - Client, 1 - Host

### Library data of the parts
C219-C247 = CMP-001-00058-1: as C65 on sheet MAX96724_PINOUT; Min Operating Temperature: -55°C; Mounting Technology: Surface Mount; Pins: 2; Case/Package: 0402; RoHS Compliant: Yes; Max Operating Temperature: 85°C
D19 = CMP-004-00040-2: as D18 on sheet LAN8830_PINOUT; Source: rgled.SchLib; Component Type: Standard; Design Item ID: CMP-004-00034-2; Pins: 4
L18 = CMP-08256-000023-1: CMC 80UH 70MA 2LN 3.8KOHM SMD
R35 = CMP-009-00002-14: Resistor; Value: 0
R261 R262 R266-R268 R271-R278 R283 R289 R290 = CMP-009-00002-14: Resistor; Value: 100k
R263-R265 = CMP-009-00002-14: Resistor; Value: 100k
U30 = CMP-015-00023-5: 100/1000BASE-T1 Rgmii/sgmii Phy; Case/Package: VQFN; Pins: 48
Y7 = CMP-2000-05733-3: as Y6 on sheet LAN8830_PINOUT; Length: 3.2mm; Depth: 2.5mm; Packaging: Tape and Reel; Min Operating Temperature: -40°C; Operating Frequency: 25 MHz; Lead Free: Lead Free; Number of Pins: 4; Frequency Tolerance: 20ppm; Radiation Hardening: No; Max Operating Temperature: 85°C; Termination: SMD/SMT; Frequency Stability: 30ppm; Frequency: 25MHz; Series: ABM8G; Mount: Surface Mount; Package Quantity: 1000; Height: 0.039inch; Width: 0.098inch; Case/Package: CSMD; ESR (Equivalent Series Resistance): 60R; Load Capacitance: 18pF; Tolerance: 20ppm

## Sheet SD.SchDoc
size A4; SheetNumber: 8; SheetTotal: 21
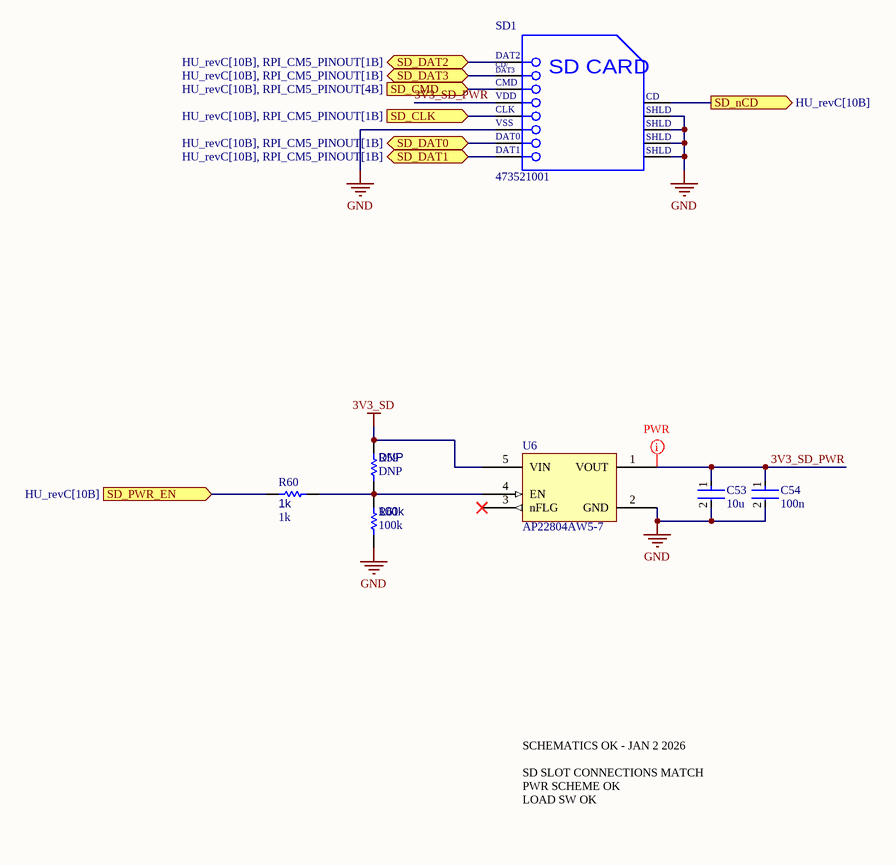
[diagram p28: SD.SchDoc]

### Parts
C53  10u  [FP-0402-L_1_0_0_05-W_0_5-IPC_A]
C54  100n  [FP-0402-L_1_0_0_05-W_0_5-IPC_A]
R59  DNP  [R0603B]
R60  1k  [R0603B]
R61  100k  [R0603B]
SD1  473521001  [MOLX-473521001_V]
U6  AP22804AW5-7  [SOT95P285X140-5N]

### Ports
SD_CLK (in, see HU_revC[10B], RPI_CM5_PINOUT[1B]), SD_CMD (in, see HU_revC[10B], RPI_CM5_PINOUT[4B]), SD_DAT0 (bidir, see HU_revC[10B], RPI_CM5_PINOUT[1B]), SD_DAT1 (bidir, see HU_revC[10B], RPI_CM5_PINOUT[1B]), SD_DAT2 (bidir, see HU_revC[10B], RPI_CM5_PINOUT[1B]), SD_DAT3 (bidir, see HU_revC[10B], RPI_CM5_PINOUT[1B]), SD_nCD (out, see HU_revC[10B]), SD_PWR_EN (in, see HU_revC[10B])

### Nets
3V3_SD: R59.2 U6.5(VIN)
GND: C53.2 C54.2 R61.1 SD1.6(VSS) SD1.10(SHLD) SD1.11(SHLD) SD1.12(SHLD) SD1.13(SHLD) U6.2(GND)
3V3_SD_PWR: C53.1 C54.1 SD1.4(VDD) U6.1(VOUT)
3V3_SD_PWR_EN: R60.2 ; port SD_PWR_EN
SD_CLK: SD1.5(CLK) ; port SD_CLK
SD_CMD: SD1.3(CMD) ; port SD_CMD
SD_DAT0: SD1.7(DAT0) ; port SD_DAT0
SD_DAT1: SD1.8(DAT1) ; port SD_DAT1
SD_DAT2: SD1.1(DAT2) ; port SD_DAT2
SD_DAT3: SD1.2(CD/DAT3) ; port SD_DAT3
NetR59_1: R59.1 R60.1 R61.2 U6.4(EN)
NetSD1_9: SD1.9(CD) ; port SD_nCD

Not connected (* = marked no-connect by the designer): U6 3(nFLG)*

### Layout directives
net class PWR: 3V3_SD_PWR

### Notes on the sheet
- SCHEMATICS OK - JAN 2 2026
  SD SLOT CONNECTIONS MATCH
  PWR SCHEME OK
  LOAD SW OK
- (in symbol CMP-2000-05848-1) CD/; DAT3; SD CARD

### Library data of the parts
C53 C54 = CMP-001-00058-1: as C65 on sheet MAX96724_PINOUT; Min Operating Temperature: -55°C; Mounting Technology: Surface Mount; Pins: 2; Case/Package: 0402; RoHS Compliant: Yes; Max Operating Temperature: 85°C
R59-R61 = CMP-009-00002-14: Resistor
  R59: Value: DNP
  R60: Value: 1k
  R61: Value: 100k
SD1 = CMP-2000-05848-1: MicroSD(TM), Pitch 1.1 mm, 8 Position, Height 1.88 mm, -20 to 85 degC, RoHS, Tape and Reel; Manufacturer: Molex; Datasheet Version: Rev. G, 01/2012; Datasheet URL: http://www.molex.com/pdm_docs/sd/473521001_sd.pdf; Package Reference: 473521001; Manufacturer URL: http://www.molex.com/; Mounting Technology: SurfaceMount; Package Description: MicroSD(TM), Pitch 1.1 mm, 8 Position, Height 1.88 mm
U6 = CMP-019-00060-1: SINGLE CHANNEL POWER DISTRIBUTION LOAD SWITCH, -40 to 85°C pF, RoHS; Max Supply Voltage: 5.5V; Min Supply Voltage: 2.7V; Max Operating Temperature: 85°C; Min Operating Temperature: -40°C

## Sheet TUSB4041_PINOUT.SchDoc
size C; SheetNumber: 17; SheetTotal: 21
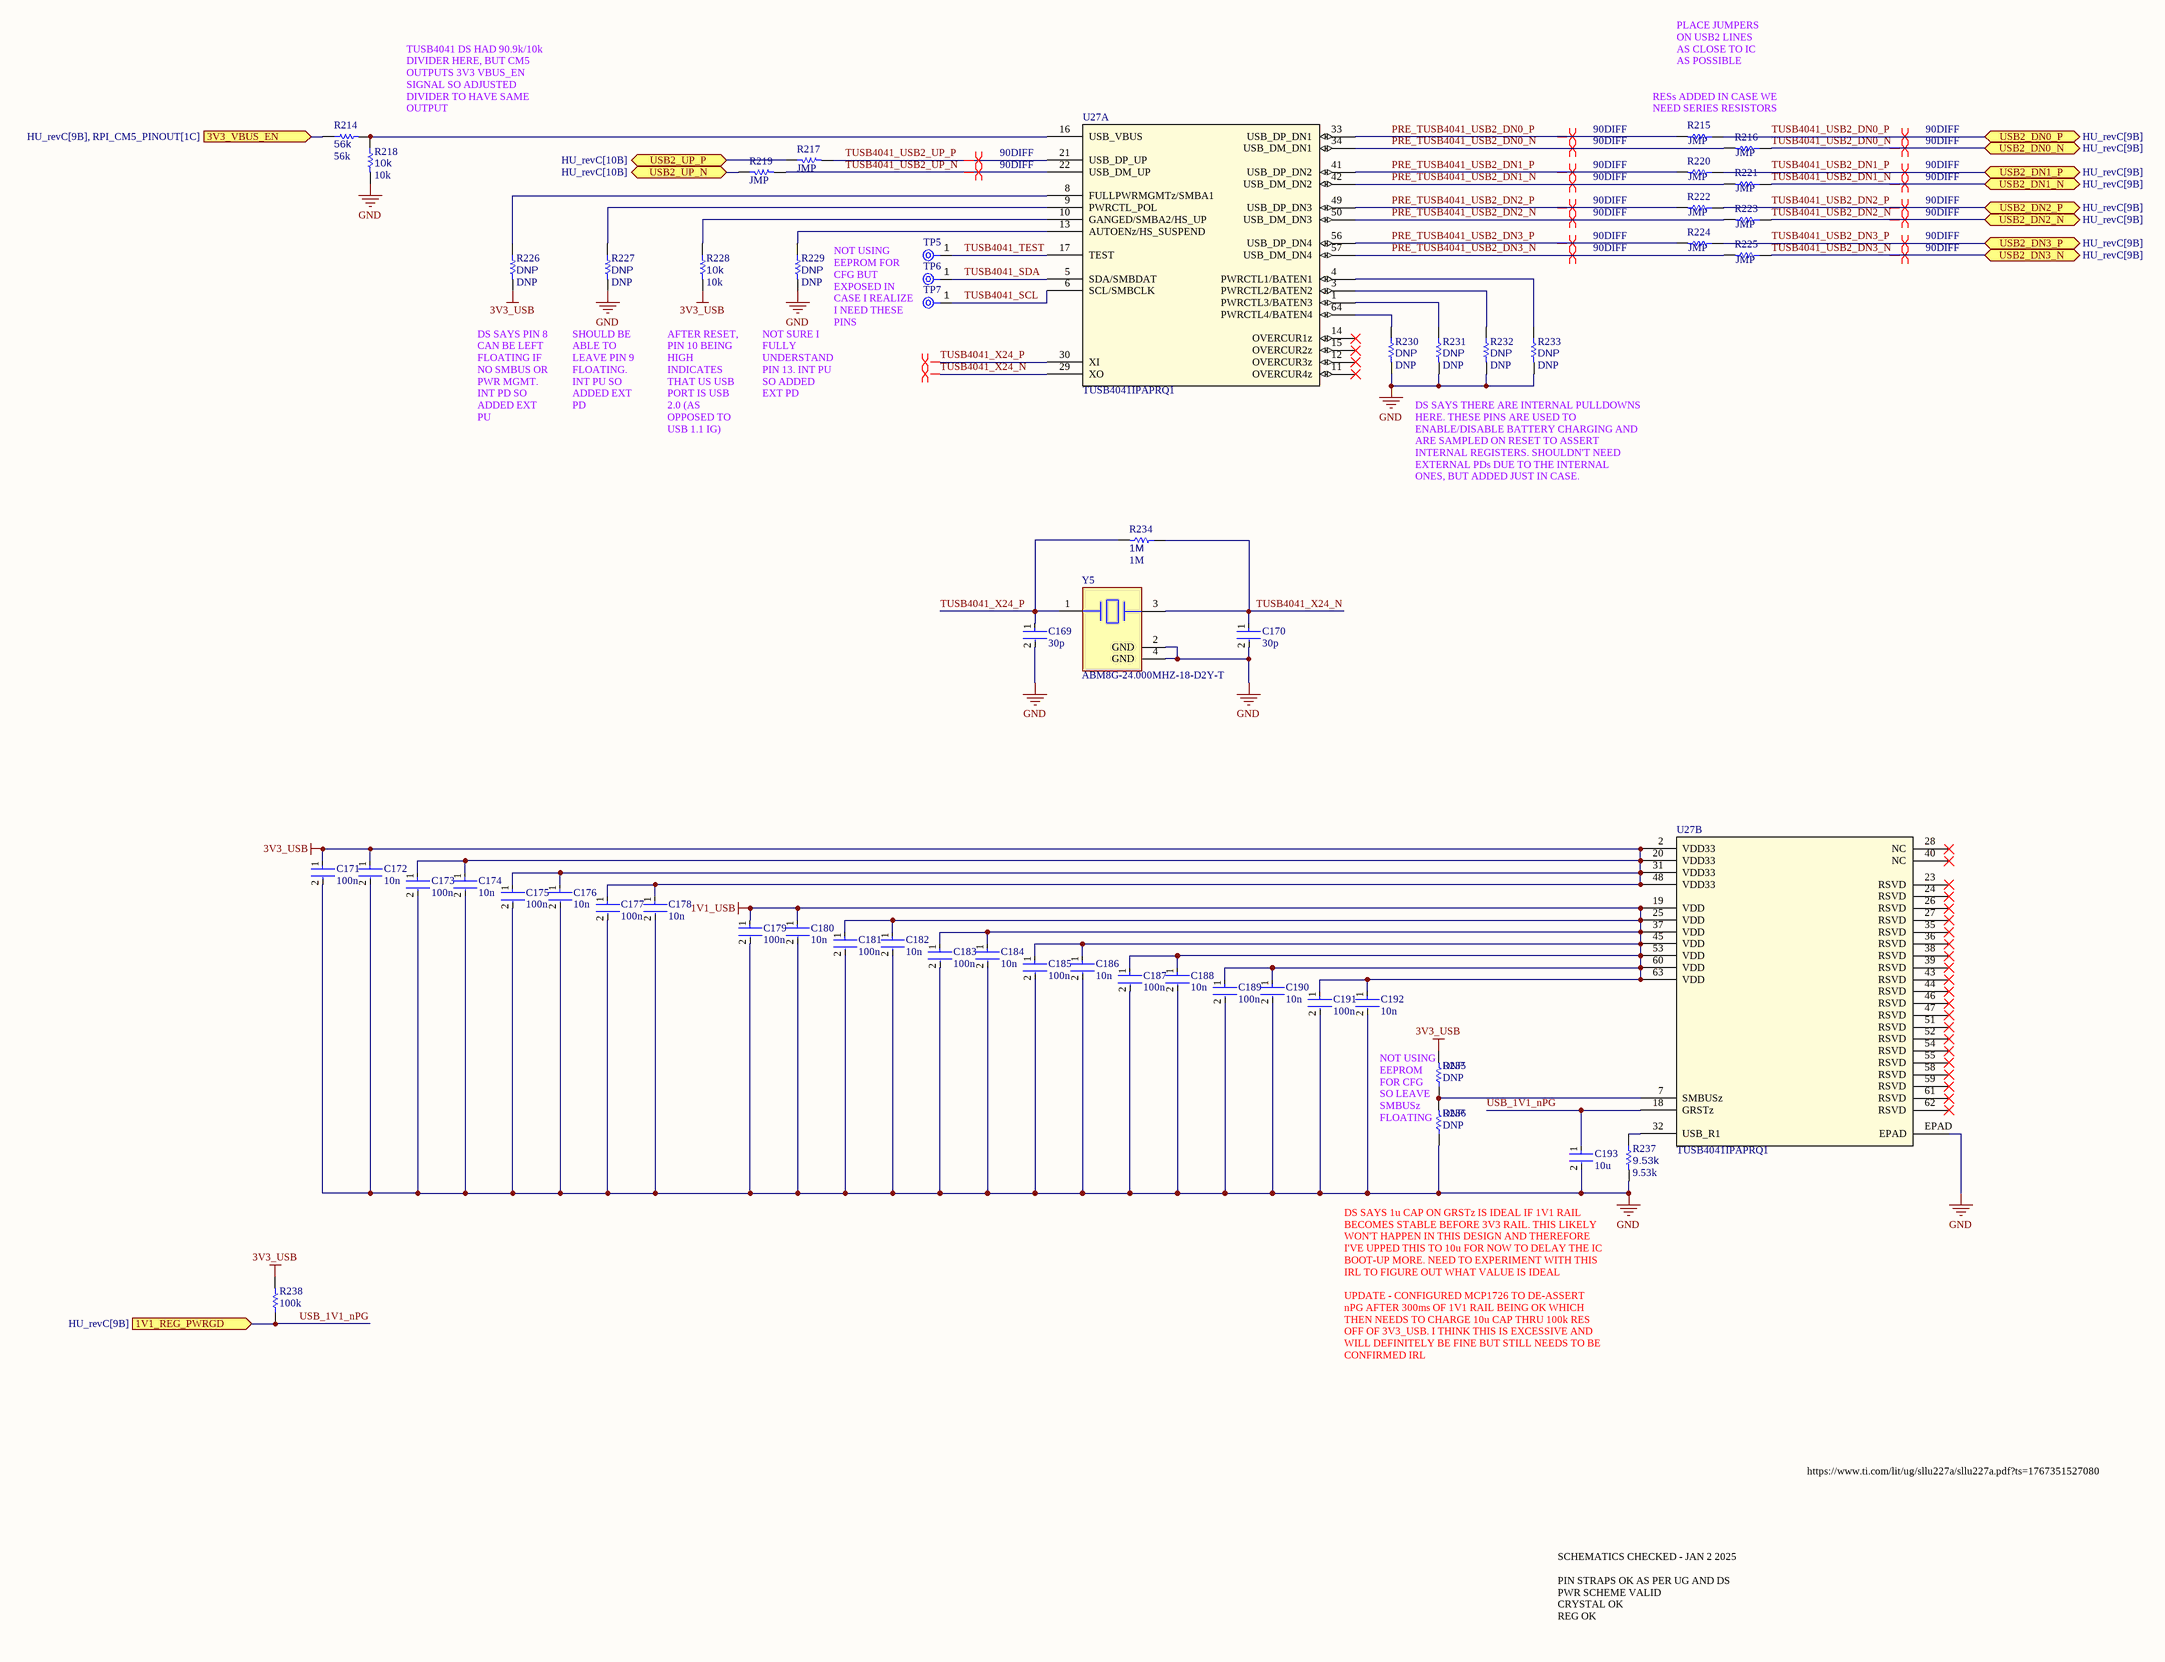
[diagram p29: TUSB4041_PINOUT.SchDoc]

### Parts
C169  30p  [FP-0402-L_1_0_0_05-W_0_5-IPC_A]
C170  30p  [FP-0402-L_1_0_0_05-W_0_5-IPC_A]
C171  100n  [FP-0402-L_1_0_0_05-W_0_5-IPC_A]
C172  10n  [FP-0402-L_1_0_0_05-W_0_5-IPC_A]
C173  100n  [FP-0402-L_1_0_0_05-W_0_5-IPC_A]
C174  10n  [FP-0402-L_1_0_0_05-W_0_5-IPC_A]
C175  100n  [FP-0402-L_1_0_0_05-W_0_5-IPC_A]
C176  10n  [FP-0402-L_1_0_0_05-W_0_5-IPC_A]
C177  100n  [FP-0402-L_1_0_0_05-W_0_5-IPC_A]
C178  10n  [FP-0402-L_1_0_0_05-W_0_5-IPC_A]
C179  100n  [FP-0402-L_1_0_0_05-W_0_5-IPC_A]
C180  10n  [FP-0402-L_1_0_0_05-W_0_5-IPC_A]
C181  100n  [FP-0402-L_1_0_0_05-W_0_5-IPC_A]
C182  10n  [FP-0402-L_1_0_0_05-W_0_5-IPC_A]
C183  100n  [FP-0402-L_1_0_0_05-W_0_5-IPC_A]
C184  10n  [FP-0402-L_1_0_0_05-W_0_5-IPC_A]
C185  100n  [FP-0402-L_1_0_0_05-W_0_5-IPC_A]
C186  10n  [FP-0402-L_1_0_0_05-W_0_5-IPC_A]
C187  100n  [FP-0402-L_1_0_0_05-W_0_5-IPC_A]
C188  10n  [FP-0402-L_1_0_0_05-W_0_5-IPC_A]
C189  100n  [FP-0402-L_1_0_0_05-W_0_5-IPC_A]
C190  10n  [FP-0402-L_1_0_0_05-W_0_5-IPC_A]
C191  100n  [FP-0402-L_1_0_0_05-W_0_5-IPC_A]
C192  10n  [FP-0402-L_1_0_0_05-W_0_5-IPC_A]
C193  10u  [FP-0402-L_1_0_0_05-W_0_5-IPC_A]
R214  56k  [R0603B]
R215  JMP  [R0603B]
R216  JMP  [R0603B]
R217  JMP  [R0603B]
R218  10k  [R0603B]
R219  JMP  [R0603B]
R220  JMP  [R0603B]
R221  JMP  [R0603B]
R222  JMP  [R0603B]
R223  JMP  [R0603B]
R224  JMP  [R0603B]
R225  JMP  [R0603B]
R226  DNP  [R0603B]
R227  DNP  [R0603B]
R228  10k  [R0603B]
R229  DNP  [R0603B]
R230  DNP  [R0603B]
R231  DNP  [R0603B]
R232  DNP  [R0603B]
R233  DNP  [R0603B]
R234  1M  [R0603B]
R235  DNP  [R0603B]
R236  DNP  [R0603B]
R237  9.53k  [R0603B]
R238  100k  [R0603B]
TP5  TPAD6R  [New footprint 1]  (value not drawn)  (no BOM)
TP6  TPAD6R  [New footprint 1]  (value not drawn)  (no BOM)
TP7  TPAD6R  [New footprint 1]  (value not drawn)  (no BOM)
U27  TUSB4041IPAPRQ1  [TUSB4041IPAPRQ1-Footprint-1]  (parts A,B of 2)
Y5  ABM8G-24.000MHZ-18-D2Y-T  [FP-ABM8G-MFG]

### Ports
1V1_REG_PWRGD (in, see HU_revC[9B]), 3V3_VBUS_EN (in, see HU_revC[9B], RPI_CM5_PINOUT[1C]), USB2_DN0_N (bidir, see HU_revC[9B]), USB2_DN0_P (bidir, see HU_revC[9B]), USB2_DN1_N (bidir, see HU_revC[9B]), USB2_DN1_P (bidir, see HU_revC[9B]), USB2_DN2_N (bidir, see HU_revC[9B]), USB2_DN2_P (bidir, see HU_revC[9B]), USB2_DN3_N (bidir, see HU_revC[9B]), USB2_DN3_P (bidir, see HU_revC[9B]), USB2_UP_N (bidir, see HU_revC[10B]), USB2_UP_P (bidir, see HU_revC[10B])

### Nets
1V1_USB: C179.1 C180.1 C181.1 C182.1 C183.1 C184.1 C185.1 C186.1 C187.1 C188.1 C189.1 C190.1 C191.1 C192.1 U27.19(VDD) U27.25(VDD) U27.37(VDD) U27.45(VDD) U27.53(VDD) U27.60(VDD) U27.63(VDD)
3V3_USB: C171.1 C172.1 C173.1 C174.1 C175.1 C176.1 C177.1 C178.1 R226.2 R228.2 R235.2 R238.2 U27.2(VDD33) U27.20(VDD33) U27.31(VDD33) U27.48(VDD33)
GND: C169.2 C170.2 C171.2 C172.2 C173.2 C174.2 C175.2 C176.2 C177.2 C178.2 C179.2 C180.2 C181.2 C182.2 C183.2 C184.2 C185.2 C186.2 C187.2 C188.2 C189.2 C190.2 C191.2 C192.2 C193.2 R218.2 R227.2 R229.2 R230.2 R231.2 R232.2 R233.2 R236.1 R237.2 U27.EPAD Y5.2(GND) Y5.4(GND)
3V3_VBUS_EN: R214.1 ; port 3V3_VBUS_EN
PRE_TUSB4041_USB2_DN0_N: R216.2 U27.34(USB_DM_DN1)
PRE_TUSB4041_USB2_DN0_P: R215.2 U27.33(USB_DP_DN1)
PRE_TUSB4041_USB2_DN1_N: R221.2 U27.42(USB_DM_DN2)
PRE_TUSB4041_USB2_DN1_P: R220.2 U27.41(USB_DP_DN2)
PRE_TUSB4041_USB2_DN2_N: R223.2 U27.50(USB_DM_DN3)
PRE_TUSB4041_USB2_DN2_P: R222.2 U27.49(USB_DP_DN3)
PRE_TUSB4041_USB2_DN3_N: R225.2 U27.57(USB_DM_DN4)
PRE_TUSB4041_USB2_DN3_P: R224.2 U27.56(USB_DP_DN4)
TUSB4041_SCL: TP7.1(TP) U27.6(SCL/SMBCLK)
TUSB4041_SDA: TP6.1(TP) U27.5(SDA/SMBDAT)
TUSB4041_TEST: TP5.1(TP) U27.17(TEST)
TUSB4041_USB2_DN0_N: R216.1 ; port USB2_DN0_N
TUSB4041_USB2_DN0_P: R215.1 ; port USB2_DN0_P
TUSB4041_USB2_DN1_N: R221.1 ; port USB2_DN1_N
TUSB4041_USB2_DN1_P: R220.1 ; port USB2_DN1_P
TUSB4041_USB2_DN2_N: R223.1 ; port USB2_DN2_N
TUSB4041_USB2_DN2_P: R222.1 ; port USB2_DN2_P
TUSB4041_USB2_DN3_N: R225.1 ; port USB2_DN3_N
TUSB4041_USB2_DN3_P: R224.1 ; port USB2_DN3_P
TUSB4041_USB2_UP_N: R219.2 U27.22(USB_DM_UP)
TUSB4041_USB2_UP_P: R217.2 U27.21(USB_DP_UP)
TUSB4041_X24_N: C170.1 R234.1 U27.29(XO) Y5.3
TUSB4041_X24_P: C169.1 R234.2 U27.30(XI) Y5.1
USB3_1_D_N: R219.1 ; port USB2_UP_N
USB3_1_D_P: R217.1 ; port USB2_UP_P
USB_1V1_nPG: C193.1 R238.1 U27.18(GRSTz) ; port 1V1_REG_PWRGD  [project net 1V1_REG_PWRGD]
NetR214_2: R214.2 R218.1 U27.16(USB_VBUS)
NetR226_1: R226.1 U27.8(FULLPWRMGMTz/SMBA1)
NetR227_1: R227.1 U27.9(PWRCTL_POL)
NetR228_1: R228.1 U27.10(GANGED/SMBA2/HS_UP)
NetR229_1: R229.1 U27.13(AUTOENz/HS_SUSPEND)
NetR230_1: R230.1 U27.64(PWRCTL4/BATEN4)
NetR231_1: R231.1 U27.1(PWRCTL3/BATEN3)
NetR232_1: R232.1 U27.3(PWRCTL2/BATEN2)
NetR233_1: R233.1 U27.4(PWRCTL1/BATEN1)
NetR235_1: R235.1 R236.2 U27.7(SMBUSz)
NetR237_1: R237.1 U27.32(USB_R1)

Not connected (* = marked no-connect by the designer): U27 11(OVERCUR4z)* 12(OVERCUR3z)* 14(OVERCUR1z)* 15(OVERCUR2z)* 23(RSVD)* 24(RSVD)* 26(RSVD)* 27(RSVD)* 28(NC)* 35(RSVD)* 36(RSVD)* 38(RSVD)* 39(RSVD)* 40(NC)* 43(RSVD)* 44(RSVD)* 46(RSVD)* 47(RSVD)* 51(RSVD)* 52(RSVD)* 54(RSVD)* 55(RSVD)* 58(RSVD)* 59(RSVD)* 61(RSVD)* 62(RSVD)*

### Layout directives
differential pair: TUSB4041_X24_N, TUSB4041_X24_P
differential pair; differential pair class 90DIFF: PRE_TUSB4041_USB2_DN0_N, PRE_TUSB4041_USB2_DN0_P, PRE_TUSB4041_USB2_DN1_N, PRE_TUSB4041_USB2_DN1_P, PRE_TUSB4041_USB2_DN2_N, PRE_TUSB4041_USB2_DN2_P, PRE_TUSB4041_USB2_DN3_N, PRE_TUSB4041_USB2_DN3_P, TUSB4041_USB2_DN0_N, TUSB4041_USB2_DN0_P, TUSB4041_USB2_DN1_N, TUSB4041_USB2_DN1_P, TUSB4041_USB2_DN2_N, TUSB4041_USB2_DN2_P, TUSB4041_USB2_DN3_N, TUSB4041_USB2_DN3_P, TUSB4041_USB2_UP_N, TUSB4041_USB2_UP_P

### Notes on the sheet
- PLACE JUMPERS ON USB2 LINES AS CLOSE TO IC AS POSSIBLE
- TUSB4041 DS HAD 90.9k/10k DIVIDER HERE, BUT CM5 OUTPUTS 3V3 VBUS_EN SIGNAL SO ADJUSTED DIVIDER TO HAVE SAME OUTPUT
- RESs ADDED IN CASE WE NEED SERIES RESISTORS
- NOT USING EEPROM FOR CFG BUT EXPOSED IN CASE I REALIZE I NEED THESE PINS
- DS SAYS PIN 8 CAN BE LEFT FLOATING IF NO SMBUS OR PWR MGMT. INT PD SO ADDED EXT PU
- SHOULD BE ABLE TO LEAVE PIN 9 FLOATING. INT PU SO ADDED EXT PD
- AFTER RESET, PIN 10 BEING HIGH INDICATES THAT US USB PORT IS USB 2.0 (AS OPPOSED TO USB 1.1 IG)
- NOT SURE I FULLY UNDERSTAND PIN 13. INT PU SO ADDED EXT PD
- DS SAYS THERE ARE INTERNAL PULLDOWNS HERE. THESE PINS ARE USED TO ENABLE/DISABLE BATTERY CHARGING AND ARE SAMPLED ON RESET TO ASSERT INTERNAL REGISTERS. SHOULDN'T NEED EXTERNAL PDs DUE TO THE INTERNAL ONES, BUT ADDED JUST IN CASE.
- NOT USING EEPROM FOR CFG SO LEAVE SMBUSz FLOATING
- DS SAYS 1u CAP ON GRSTz IS IDEAL IF 1V1 RAIL BECOMES STABLE BEFORE 3V3 RAIL. THIS LIKELY WON'T HAPPEN IN THIS DESIGN AND THEREFORE I'VE UPPED THIS TO 10u FOR NOW TO DELAY THE IC BOOT-UP MORE. NEED TO EXPERIMENT WITH THIS IRL TO FIGURE OUT WHAT VALUE IS IDEAL
- UPDATE - CONFIGURED MCP1726 TO DE-ASSERT nPG AFTER 300ms OF 1V1 RAIL BEING OK WHICH THEN NEEDS TO CHARGE 10u CAP THRU 100k RES OFF OF 3V3_USB. I THINK THIS IS EXCESSIVE AND WILL DEFINITELY BE FINE BUT STILL NEEDS TO BE CONFIRMED IRL
- https://www.ti.com/lit/ug/sllu227a/sllu227a.pdf?ts=1767351527080
- SCHEMATICS CHECKED - JAN 2 2025
  PIN STRAPS OK AS PER UG AND DS
  PWR SCHEME VALID
  CRYSTAL OK
  REG OK

### Library data of the parts
C169-C193 = CMP-001-00058-1: LARGE PADS, 0402 CAP, CHANGE COMMENT TO MATCH REAL P/N; Capacitor Type: Ceramic; Min Operating Temperature: -55°C; Mounting Technology: Surface Mount; Pins: 2; Case/Package: 0402; RoHS Compliant: Yes; Max Operating Temperature: 85°C
R214-R238 = CMP-009-00002-14: Resistor
  R214: Value: 56k
  R218 R228: Value: 10k
  R226 R227 R229-R233 R235 R236: Value: DNP
  R234: Value: 1M
  R237: Value: 9.53k
  R238: Value: 100k
TP5-TP7 = CMP-00025-3: Test Point .6mm
U27 = CMP-015-00024-1: IC USB 2.0 4PORT HUB 64HTQFP USB Hub Controller USB 2.0 USB Interface 64-HTQFP (10x10); Max Operating Temperature: 85°C; Pins: 64; Min Operating Temperature: -40°C
Y5 = CMP-27762-003871-2: Crystal 24MHz ±20ppm (Tol) ±30ppm (Stability) 18pF FUND 60Ω 4-Pin SMD T/R; ESR (Equivalent Series Resistance): 60R; Load Capacitance: 18pF; Height: 0.039inch; Operating Frequency: 24 MHz; Tolerance: 20ppm; Packaging: Tape and Reel; Case/Package: CSMD; Mount: Surface Mount; Number of Pins: 4; Length: 3.2mm; Series: ABM8G; Lead Free: Lead Free; Package Quantity: 1000; Series Resistance: 60R; Frequency Tolerance: 20ppm; Min Operating Temperature: -40°C; Termination: SMD/SMT; Radiation Hardening: No; Frequency: 24MHz; Frequency Stability: 30ppm; Depth: 2.5mm; Width: 0.098inch; Max Operating Temperature: 85°C

## Sheet ADJ_REG.SchDoc
size A; SheetNumber: 21; SheetTotal: 21
Used 4 times, as channels REG_3, REG_4, REG_5, REG_6. Parts and nets are listed once, with the designators drawn on the sheet.
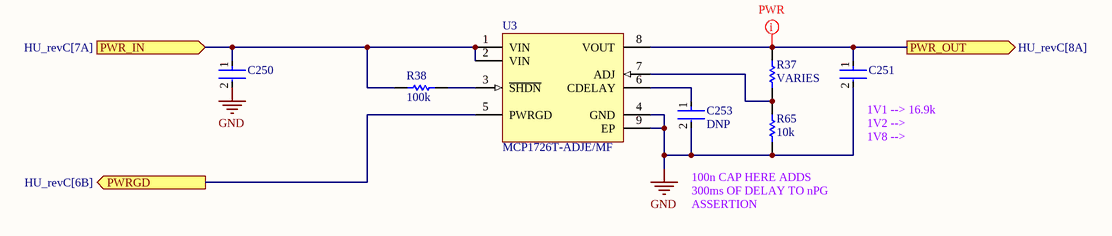
[diagram p30: ADJ_REG.SchDoc]

### Parts
C250  C0805C475J4RACAUTO  [FP-C0805C475J4RACAUTO-MFG]  (value not drawn)
C251  GRM21BR61E226ME44L  [FP-GRM21B-0_2-e0_2_0_7-IPC_B]  (value not drawn)
C253  DNP  [FP-0402-L_1_0_0_05-W_0_5-IPC_A]
R37  VARIES  [R0603B]
R38  100k  [R0603B]
R65  10k  [R0603B]
U3  MCP1726T-ADJE/MF  [DFN-MF8]

### Ports
PWR_IN (in, see HU_revC[7A]), PWR_OUT (out, see HU_revC[8A]), PWRGD (out, see HU_revC[6B])

### Nets
GND: C250.2 C251.2 C253.2 R65.1 U3.4(GND) U3.9(EP)
PWR_IN: C250.1 R38.1 U3.1(VIN) U3.2(VIN) ; port PWR_IN
PWR_OUT: C251.1 R37.2 U3.8(VOUT) ; port PWR_OUT
PWRGD: U3.5(PWRGD) ; port PWRGD
NetC253_1: C253.1 U3.6(CDELAY)
NetR37_1: R37.1 R65.2 U3.7(ADJ)
NetR38_2: R38.2 U3.3(~{SHDN})

### Channels
REG_3: designators end in _REG_3; ports PWR_IN=3V3_LAN PWR_OUT=1V1_LAN PWRGD=NetU3_REG_3_5
REG_4: designators end in _REG_4; ports PWR_IN=3V3_DES_0 PWR_OUT=1V2_DES_0 PWRGD=NetU3_REG_4_5
REG_5: designators end in _REG_5; ports PWR_IN=3V3_DES_0 PWR_OUT=1V8_DES_0 PWRGD=NetU3_REG_5_5
REG_6: designators end in _REG_6; ports PWR_IN=3V3_USB PWR_OUT=1V1_USB PWRGD=1V1_REG_PWRGD

### Layout directives
net class PWR: 1V1_LAN

### Notes on the sheet
- (near C251) 1V1 --> 16.9k
  1V2 -->
  1V8 -->
- (near R65) 100n CAP HERE ADDS 300ms OF DELAY TO nPG ASSERTION

### Library data of the parts
C250 = CMP-00212-84766729-1: C0805C475J4RACAUTO Cap Ceramic 4.7uF 16V X7R 5% Pad SMD 0805 125C Automotive T/R; Capacitance: 4.7µF; Max Operating Temperature: 125°C; Dielectric Material: Ceramic; Voltage Rating (DC): 16V; Dielectric: X7R; Height: 1.4mm; Case/Package: 0805; NexarPartId: 84766729; Voltage Rating: 16V; RoHS: Compliant; Material: Ceramic; Packaging: Cut Tape; Tolerance: 5%; Min Operating Temperature: -55°C
C251 = CMP-2007-03222-3: Chip Multilayer Ceramic Capacitors for General Purpose, 0805, 22uF, X5R, 15%, 20%, 25V; Case/Package: 0805; Depth: 1.25mm; Resistor Type: Ceramic; Voltage Rating: 25V; Lead Free: Lead Free; Voltage Rating (DC): 25V; Case Code (Metric): 2012; Thickness: 0.057inch; REACH SVHC: No SVHC; Material: Ceramic; Tolerance: 20%; Length: 2mm; Capacitance: 22uF; Case Code (Imperial): 0805; Max Operating Temperature: 85°C; Termination: SMD/SMT; Weight: 0.000335oz; Dielectric: X5R; Packaging: Tape and Reel; Voltage: 25V; Package Quantity: 3000; Height: 1.25mm; Mount: Surface Mount; Width: 1.25mm; Min Operating Temperature: -55°C
C253 = CMP-001-00058-1: as C169-C193 on sheet TUSB4041_PINOUT; Min Operating Temperature: -55°C; Mounting Technology: Surface Mount; Pins: 2; Case/Package: 0402; RoHS Compliant: Yes; Max Operating Temperature: 85°C
R37 R38 R65 = CMP-009-00002-14: Resistor
  R37: Value: VARIES
  R38: Value: 100k
  R65: Value: 10k
U3 = CMP-0136-00358-1: 1A, Low Voltage, Low Quiescent Current LDO Regulator, 8-Pin DFN, Extended Temperature, Tape and Reel; DatasheetVersion: revC, Aug-2007; PackageDescription: 8-Lead Plastic Dual Flat, No Lead Package (MF) - 3x3x0.9mm Body [DFN]; PackageVersion: revBB, Aug-2009; PackageReference: DFN-MF8

## Nets that join several sheets
1V1_LAN: LAN8830_PINOUT (17 pins), LAN8870_PINOUT (17 pins), REG_3 (C251_REG_3.1 R37_REG_3.2 U3_REG_3.8)
1V1_USB: TUSB4041_PINOUT (21 pins), REG_6 (C251_REG_6.1 R37_REG_6.2 U3_REG_6.8)
1V2_DES_0: MAX96724_PINOUT (10 pins), REG_4 (C251_REG_4.1 R37_REG_4.2 U3_REG_4.8)
1V8_DES_0: MAX96724_PINOUT (7 pins), REG_5 (C251_REG_5.1 R37_REG_5.2 U3_REG_5.8)
3V3_CAN: HU_revC (F25.2), MCP2515_PINOUT (5 pins), TCAN1146_PINOUT (C161.1 U24.5)
3V3_DES_0: HU_revC (F12.1), MAX96724_PINOUT (13 pins), REG_4 (C250_REG_4.1 R38_REG_4.1 U3_REG_4.1 U3_REG_4.2), REG_5 (C250_REG_5.1 R38_REG_5.1 U3_REG_5.1 U3_REG_5.2)
3V3_GPS: HU_revC (F21.2), MAX_M10M_PINOUT (8 pins)
3V3_LAN: HU_revC (F19.1), LAN8830_PINOUT (20 pins), LAN8870_PINOUT (18 pins), REG_3 (C250_REG_3.1 R38_REG_3.1 U3_REG_3.1 U3_REG_3.2)
3V3_LED: HU_revC (D9.2 D9.3 J18.2), CM6206_PINOUT (D25.2 D25.3), RPI_CM5_PINOUT (D2.2 D2.3), NVME (D4.2 D4.3), MAX96724_PINOUT (Q3.1 Q3.4 R79.2 R89.1), MAX_M10M_PINOUT (D8.2 D8.3), LAN8830_PINOUT (D18.2 D18.3), LAN8870_PINOUT (D19.2 D19.3)
3V3_M2: HU_revC (F1.1), NVME (R48.2 U31.5)
3V3_MAIN: HU_revC (5 pins), RPI_CM5_PINOUT (5 pins)
3V3_PWR: HU_revC (C119.1 F14.1 R144.1 U17.5), 5V0_REG (R33.1), ADC_0 (C50_ADC_0.1 R58_ADC_0.1 U5_ADC_0.2), 3V3_REG (R62.1), PWR_SW (C114.1 R119.2 U13.12), OR_0 (R194_OR_0.2), OR_1 (R194_OR_1.2), PWR_SW_AND_VI_SENSE (C167.1 R206.2 U25.12), PWR_PROT_0 (C168_PWR_PROT_0.1 R213_PWR_PROT_0.2 U26_PWR_PROT_0.12), PWR_PROT_1 (C168_PWR_PROT_1.1 R213_PWR_PROT_1.2 U26_PWR_PROT_1.12), PWR_PROT_2 (C168_PWR_PROT_2.1 R213_PWR_PROT_2.2 U26_PWR_PROT_2.12), ADC_1 (C50_ADC_1.1 R58_ADC_1.1 U5_ADC_1.2)
3V3_REG_FB: HU_revC (6 pins), 3V3_REG (9 pins)
3V3_SD: HU_revC (F23.2), SD (R59.2 U6.5)
3V3_USB: HU_revC (F11.1), TUSB4041_PINOUT (16 pins), REG_6 (C250_REG_6.1 R38_REG_6.1 U3_REG_6.1 U3_REG_6.2)
5V0_CAN: HU_revC (F24.2), TCAN1146_PINOUT (C160.1 U24.3)
5V0_DAC: HU_revC (F8.1), CM6206_PINOUT (13 pins)
5V0_MAIN: HU_revC (9 pins), 5V0_REG (13 pins)
5V0_RPI: HU_revC (F9.1), RPI_CM5_PINOUT (13 pins)
12V0_PoC: HU_revC (C260.1 C261.1 C262.1 C263.1), MAX96724_PINOUT (F2.2 F3.2 F4.2 F5.2), PWR_PROT_0 (U26_PWR_PROT_0.3 U26_PWR_PROT_0.4)
AMP_VCC: HU_revC (6 pins), PWR_SW (U13.3 U13.4)
APM_VCC: HU_revC (J3.10 J3.21 J3.33 R147.2), OR_1 (6 pins)
CAR_VCC: HU_revC (J3.12 J3.23 J3.35), OR_0 (6 pins)
GND: HU_revC (90 pins), CM6206_PINOUT (30 pins), RPI_CM5_PINOUT (68 pins), 5V0_REG (31 pins), NVME (32 pins), MCP2515_PINOUT (8 pins), ADC_0 (5 pins), 3V3_REG (16 pins), MAX96724_PINOUT (56 pins), PWR_SW (C114.2 Q9.2 R123.1 U13.5), MAX_M10M_PINOUT (12 pins), TCAN1146_PINOUT (10 pins), OR_0 (21 pins), OR_1 (21 pins), PWR_SW_AND_VI_SENSE (6 pins), PWR_PROT_0 (C168_PWR_PROT_0.2 U26_PWR_PROT_0.5), PWR_PROT_1 (C168_PWR_PROT_1.2 U26_PWR_PROT_1.5), PWR_PROT_2 (C168_PWR_PROT_2.2 U26_PWR_PROT_2.5), LAN8830_PINOUT (33 pins), LAN8870_PINOUT (36 pins), ADC_1 (5 pins), SD (9 pins), TUSB4041_PINOUT (37 pins), REG_3 (6 pins), REG_4 (6 pins), REG_5 (6 pins), REG_6 (6 pins)
INT_VCC: PWR_SW (F6.1), PWR_SW_AND_VI_SENSE (R211.2 U25.3 U25.4), PWR_PROT_0 (F18_PWR_PROT_0.1), PWR_PROT_1 (F18_PWR_PROT_1.1), PWR_PROT_2 (F18_PWR_PROT_2.1)
MATENET_GND: HU_revC (5 pins), LAN8870_PINOUT (C221.1 R264.2)
PRE_VCC: TCAN1146_PINOUT (D15.2), OR_0 (6 pins), OR_1 (6 pins), PWR_SW_AND_VI_SENSE (7 pins)
1V1_REG_PWRGD: TUSB4041_PINOUT (C193.1 R238.1 U27.18), REG_6 (U3_REG_6.5)
3V3_3V3_MAIN_T_SENSE: 3V3_REG (R62.2 R64.2), ADC_1 (U5_ADC_1.11)
3V3_3V3_MAIN_V_SENSE: 3V3_REG (R68.1 R69.2), ADC_1 (U5_ADC_1.9)
3V3_3V3_VCC_I_SENSE: PWR_PROT_2 (U26_PWR_PROT_2.11), ADC_1 (U5_ADC_1.8)
3V3_5V0_MAIN_T_SENSE: 5V0_REG (R33.2 R36.2), ADC_1 (U5_ADC_1.4)
3V3_5V0_MAIN_V_SENSE: 5V0_REG (D21.1 R39.1 R40.2), ADC_1 (U5_ADC_1.10)
3V3_5V0_VCC_I_SENSE: PWR_PROT_1 (U26_PWR_PROT_1.11), ADC_1 (U5_ADC_1.5)
3V3_12V_VCC_I_SENSE: ADC_0 (U5_ADC_0.11), PWR_PROT_0 (U26_PWR_PROT_0.11)
3V3_AMP_I_SENSE: ADC_0 (U5_ADC_0.5), PWR_SW (U13.11)
3V3_AMP_PWR_EN: RPI_CM5_PINOUT (J1.58), PWR_SW (R122.1)
3V3_CAM_GPIO0: RPI_CM5_PINOUT (J1.97), MAX96724_PINOUT (R99.1 U9.11)
3V3_CAN_RX: MCP2515_PINOUT (U4.20), TCAN1146_PINOUT (U24.4)
3V3_CAN_TX: MCP2515_PINOUT (U4.19), TCAN1146_PINOUT (U24.1)
3V3_CAR_APM_I_SENSE: ADC_0 (U5_ADC_0.10), OR_1 (D14_OR_1.1 R198_OR_1.2 U23_OR_1.10)
3V3_CAR_APM_V_SENSE: ADC_0 (U5_ADC_0.9), OR_1 (D11_OR_1.1 R187_OR_1.1 R188_OR_1.2)
3V3_CAR_VCC_I_SENSE: ADC_0 (U5_ADC_0.8), OR_0 (D14_OR_0.1 R198_OR_0.2 U23_OR_0.10)
3V3_CAR_VCC_INH: HU_revC (U17.2), RPI_CM5_PINOUT (J1.47)
3V3_CAR_VCC_V_SENSE: ADC_0 (U5_ADC_0.7), OR_0 (D11_OR_0.1 R187_OR_0.1 R188_OR_0.2)
3V3_CPU_FAN_TACHO: HU_revC (R156.2 R160.2), RPI_CM5_PINOUT (J1.16)
3V3_I2C0_SCL: RPI_CM5_PINOUT (J1.80 R180.1), MAX96724_PINOUT (U9.29 U12.4)
3V3_I2C0_SDA: RPI_CM5_PINOUT (J1.82 R179.1), MAX96724_PINOUT (U9.28 U12.5)
3V3_INPUT_I_SENSE: ADC_0 (U5_ADC_0.6), PWR_SW_AND_VI_SENSE (U25.11)
3V3_INPUT_V_SENSE: ADC_0 (U5_ADC_0.4), PWR_SW_AND_VI_SENSE (D17.1 R211.1 R212.2)
3V3_PCIE_nCLKREQ: RPI_CM5_PINOUT (J1.102), NVME (R42.2)
3V3_PCIE_nRST: RPI_CM5_PINOUT (J1.109), NVME (R41.2 R46.1)
3V3_PCIE_nWAKE: RPI_CM5_PINOUT (J1.104), NVME (R43.2)
3V3_PCIE_PWR_EN: RPI_CM5_PINOUT (J1.106), NVME (R50.2)
3V3_PWM0_CH0 (GPIO12): HU_revC (R159.1), RPI_CM5_PINOUT (J1.31)
3V3_PWM0_CH1 (GPIO13): HU_revC (R157.2 R158.2 R162.2), RPI_CM5_PINOUT (J1.28)
3V3_PWR_nFLT: HU_revC (R178.2), PWR_SW (R119.1 U13.6), OR_0 (R194_OR_0.1 U23_OR_0.12), OR_1 (R194_OR_1.1 U23_OR_1.12), PWR_SW_AND_VI_SENSE (R206.1 U25.6), PWR_PROT_0 (R213_PWR_PROT_0.1 U26_PWR_PROT_0.6), PWR_PROT_1 (R213_PWR_PROT_1.1 U26_PWR_PROT_1.6), PWR_PROT_2 (R213_PWR_PROT_2.1 U26_PWR_PROT_2.6)
3V3_SD_PWR_EN: RPI_CM5_PINOUT (J1.75), SD (R60.2)
3V3_SPI0_MISO (GPIO9): RPI_CM5_PINOUT (J1.40), ADC_0 (U5_ADC_0.15), ADC_1 (U5_ADC_1.15)
3V3_SPI0_MOSI (GPIO10): RPI_CM5_PINOUT (J1.44), ADC_0 (U5_ADC_0.14), ADC_1 (U5_ADC_1.14)
3V3_SPI0_nCS0 (GPIO8): RPI_CM5_PINOUT (J1.39), ADC_0 (U5_ADC_0.1)
3V3_SPI0_nCS2 (GPIO3): RPI_CM5_PINOUT (J1.56), ADC_1 (U5_ADC_1.1)
3V3_SPI0_SCLK (GPIO11): RPI_CM5_PINOUT (J1.38), ADC_0 (U5_ADC_0.16), ADC_1 (U5_ADC_1.16)
3V3_SPI1_MISO (GPIO19): HU_revC (R141.2), RPI_CM5_PINOUT (J1.26), MCP2515_PINOUT (U4.15)
3V3_SPI1_MOSI (GPIO20): HU_revC (R140.2), RPI_CM5_PINOUT (J1.27), MCP2515_PINOUT (U4.14)
3V3_SPI1_nCS0 (GPIO18): RPI_CM5_PINOUT (J1.49), MCP2515_PINOUT (U4.16)
3V3_SPI1_nCS1 (GPIO27): HU_revC (R143.2), RPI_CM5_PINOUT (J1.48 R23.2)
3V3_SPI1_nCS2 (GPIO16): HU_revC (R146.2), RPI_CM5_PINOUT (J1.29)
3V3_SPI1_SCLK (GPIO21): HU_revC (R142.2), RPI_CM5_PINOUT (J1.25), MCP2515_PINOUT (U4.12)
3V3_SPI3_SCLK (GPIO7): HU_revC (R148.2), RPI_CM5_PINOUT (J1.37)
3V3_TCAN1146_MISO: HU_revC (R141.1), TCAN1146_PINOUT (U24.6)
3V3_TCAN1146_MOSI: HU_revC (R140.1), TCAN1146_PINOUT (U24.11)
3V3_TCAN1146_nCS: HU_revC (R143.1), TCAN1146_PINOUT (U24.14)
3V3_TCAN1146_SCLK: HU_revC (R142.1), TCAN1146_PINOUT (U24.8)
3V3_UART0_RX (GPIO15): HU_revC (R163.1), RPI_CM5_PINOUT (J1.51)
3V3_UART0_TX (GPIO14): HU_revC (R164.1), RPI_CM5_PINOUT (J1.55)
3V3_VBUS_EN: HU_revC (R138.2 R150.2), RPI_CM5_PINOUT (J1.111), TUSB4041_PINOUT (R214.1)
5V0_HDMI0_CEC: HU_revC (D28.1 D28.10 J4.13), RPI_CM5_PINOUT (J1.151)
5V0_HDMI0_HOTP: HU_revC (D28.5 D28.6 J4.19), RPI_CM5_PINOUT (J1.153)
5V0_HDMI0_SCL: HU_revC (D28.2 D28.9 J4.15), RPI_CM5_PINOUT (J1.200)
5V0_HDMI0_SDA: HU_revC (D28.4 D28.7 J4.16), RPI_CM5_PINOUT (J1.199)
5V0_HDMI1_CEC: HU_revC (D29.1 D29.10 J6.13), RPI_CM5_PINOUT (J1.149)
5V0_HDMI1_HOTP: HU_revC (D29.5 D29.6 J6.19), RPI_CM5_PINOUT (J1.143)
5V0_HDMI1_SCL: HU_revC (D29.2 D29.9 J6.15), RPI_CM5_PINOUT (J1.147)
5V0_HDMI1_SDA: HU_revC (D29.4 D29.7 J6.16), RPI_CM5_PINOUT (J1.145)
5V0_USB2_CC1: HU_revC (R167.1), RPI_CM5_PINOUT (J1.94)
5V0_USB2_CC2: HU_revC (R168.1), RPI_CM5_PINOUT (J1.96)
AMBIENT_TEMP: HU_revC (R144.2 R145.2), ADC_1 (U5_ADC_1.6)
CAN_N: HU_revC (J3.24), TCAN1146_PINOUT (C164.1 D16.1 L17.4 R204.2)
CAN_P: HU_revC (J3.25), TCAN1146_PINOUT (C166.2 D16.2 L17.1 R205.1)
DPHY0_CK_N: RPI_CM5_PINOUT (J1.127), MAX96724_PINOUT (U9.40)
DPHY0_CK_P: RPI_CM5_PINOUT (J1.129), MAX96724_PINOUT (U9.39)
DPHY0_D0_N: RPI_CM5_PINOUT (J1.115), MAX96724_PINOUT (U9.32)
DPHY0_D0_P: RPI_CM5_PINOUT (J1.117), MAX96724_PINOUT (U9.31)
DPHY0_D1_N: RPI_CM5_PINOUT (J1.121), MAX96724_PINOUT (U9.36)
DPHY0_D1_P: RPI_CM5_PINOUT (J1.123), MAX96724_PINOUT (U9.35)
DPHY0_D2_N: RPI_CM5_PINOUT (J1.133), MAX96724_PINOUT (U9.38)
DPHY0_D2_P: RPI_CM5_PINOUT (J1.135), MAX96724_PINOUT (U9.37)
DPHY0_D3_N: RPI_CM5_PINOUT (J1.139), MAX96724_PINOUT (U9.42)
DPHY0_D3_P: RPI_CM5_PINOUT (J1.141), MAX96724_PINOUT (U9.41)
DPHY1_CK_N: RPI_CM5_PINOUT (J1.187), MAX96724_PINOUT (U9.46)
DPHY1_CK_P: RPI_CM5_PINOUT (J1.189), MAX96724_PINOUT (U9.45)
DPHY1_D0_N: RPI_CM5_PINOUT (J1.175), MAX96724_PINOUT (U9.44)
DPHY1_D0_P: RPI_CM5_PINOUT (J1.177), MAX96724_PINOUT (U9.43)
DPHY1_D1_N: RPI_CM5_PINOUT (J1.181), MAX96724_PINOUT (U9.48)
DPHY1_D1_P: RPI_CM5_PINOUT (J1.183), MAX96724_PINOUT (U9.47)
DPHY1_D2_N: RPI_CM5_PINOUT (J1.193), MAX96724_PINOUT (U9.50)
DPHY1_D2_P: RPI_CM5_PINOUT (J1.195), MAX96724_PINOUT (U9.49)
DPHY1_D3_N: RPI_CM5_PINOUT (J1.194), MAX96724_PINOUT (U9.54)
DPHY1_D3_P: RPI_CM5_PINOUT (J1.196), MAX96724_PINOUT (U9.53)
ETH_TRD0_N: RPI_CM5_PINOUT (J1.10), LAN8830_PINOUT (U29.3)
ETH_TRD0_P: RPI_CM5_PINOUT (J1.12), LAN8830_PINOUT (U29.2)
ETH_TRD1_N: RPI_CM5_PINOUT (J1.6), LAN8830_PINOUT (U29.6)
ETH_TRD1_P: RPI_CM5_PINOUT (J1.4), LAN8830_PINOUT (U29.5)
ETH_TRD2_N: RPI_CM5_PINOUT (J1.9), LAN8830_PINOUT (U29.8)
ETH_TRD2_P: RPI_CM5_PINOUT (J1.11), LAN8830_PINOUT (U29.7)
ETH_TRD3_N: RPI_CM5_PINOUT (J1.5), LAN8830_PINOUT (U29.11)
ETH_TRD3_P: RPI_CM5_PINOUT (J1.3), LAN8830_PINOUT (U29.10)
HDMI0_CK_N: HU_revC (D26.5 D26.6 J4.12), RPI_CM5_PINOUT (J1.190)
HDMI0_CK_P: HU_revC (D26.4 D26.7 J4.10), RPI_CM5_PINOUT (J1.188)
HDMI0_D0_N: HU_revC (D26.2 D26.9 J4.9), RPI_CM5_PINOUT (J1.184)
HDMI0_D0_P: HU_revC (D26.1 D26.10 J4.7), RPI_CM5_PINOUT (J1.182)
HDMI0_D1_N: HU_revC (D3.5 D3.6 J4.6), RPI_CM5_PINOUT (J1.178)
HDMI0_D1_P: HU_revC (D3.4 D3.7 J4.4), RPI_CM5_PINOUT (J1.176)
HDMI0_D2_N: HU_revC (D3.2 D3.9 J4.3), RPI_CM5_PINOUT (J1.172)
HDMI0_D2_P: HU_revC (D3.1 D3.10 J4.1), RPI_CM5_PINOUT (J1.170)
HDMI1_CK_N: HU_revC (D27.5 D27.6 J6.12), RPI_CM5_PINOUT (J1.166)
HDMI1_CK_P: HU_revC (D27.4 D27.7 J6.10), RPI_CM5_PINOUT (J1.164)
HDMI1_D0_N: HU_revC (D27.2 D27.9 J6.9), RPI_CM5_PINOUT (J1.160)
HDMI1_D0_P: HU_revC (D27.1 D27.10 J6.7), RPI_CM5_PINOUT (J1.158)
HDMI1_D1_N: HU_revC (D23.5 D23.6 J6.6), RPI_CM5_PINOUT (J1.154)
HDMI1_D1_P: HU_revC (D23.4 D23.7 J6.4), RPI_CM5_PINOUT (J1.152)
HDMI1_D2_N: HU_revC (D23.2 D23.9 J6.3), RPI_CM5_PINOUT (J1.148)
HDMI1_D2_P: HU_revC (D23.1 D23.10 J6.1), RPI_CM5_PINOUT (J1.146)
HV_CPU_FAN_PWM: HU_revC (R152.2 R154.2), RPI_CM5_PINOUT (J1.19)
HV_PWR_EN: TCAN1146_PINOUT (U24.7), OR_0 (U23_OR_0.7), OR_1 (U23_OR_1.7), PWR_SW_AND_VI_SENSE (R209.1)
LAN8830_CLK125_EN: HU_revC (R295.2), LAN8830_PINOUT (R254.2 U29.34)
LAN8830_MODE0: HU_revC (R279.2), LAN8830_PINOUT (R246.2 U29.33)
LAN8830_MODE1: HU_revC (R291.2), LAN8830_PINOUT (R247.2 U29.32)
LAN8830_MODE2: HU_revC (R292.2), LAN8830_PINOUT (R248.2 U29.30)
LAN8830_MODE3: HU_revC (R293.2), LAN8830_PINOUT (R249.2 U29.29)
LAN8830_MODE4: HU_revC (R294.2), LAN8830_PINOUT (R245.2 U29.36)
LAN8830_RESET_N: LAN8830_PINOUT (C197.1 R242.2 U29.43), LAN8870_PINOUT (C222.1 R263.2 R275.2 U30.39)
LAN8870_RXCTL: HU_revC (R270.1), LAN8870_PINOUT (R268.2 U30.17)
LAN8870_RXD0: HU_revC (R52.1), LAN8870_PINOUT (R274.1 U30.11)
LAN8870_RXD1: HU_revC (R53.1), LAN8870_PINOUT (R272.1 U30.12)
LAN8870_RXD2: HU_revC (R54.1), LAN8870_PINOUT (R271.1 U30.14)
LAN8870_RXD3: HU_revC (R55.1), LAN8870_PINOUT (R277.2 U30.15)
LL_FR_L: HU_revC (J9.6), CM6206_PINOUT (C1.2 R4.2)
LL_FR_R: HU_revC (J9.8), CM6206_PINOUT (C2.2 R7.2)
LL_RR_L: HU_revC (J8.6), CM6206_PINOUT (C3.2 R11.2)
LL_RR_R: HU_revC (J8.8), CM6206_PINOUT (C4.2 R14.2)
MAX96724_PoC_A: HU_revC (J12.2), MAX96724_PINOUT (C65.2 L5.2)
MAX96724_PoC_B: HU_revC (J12.1), MAX96724_PINOUT (C69.2 L8.2)
MAX96724_PoC_C: HU_revC (J12.4), MAX96724_PINOUT (C73.2 L11.2)
MAX96724_PoC_D: HU_revC (J12.3), MAX96724_PINOUT (C79.2 L14.2)
MAX_M10M_RF_IN: HU_revC (D32.1 D32.10 J16.1), MAX_M10M_PINOUT (L15.2 U14.11)
MIC_P: HU_revC (J3.27), CM6206_PINOUT (C6.2 C7.2 R20.1)
NetC27_1: 5V0_REG (13 pins), PWR_PROT_1 (U26_PWR_PROT_1.3 U26_PWR_PROT_1.4)
NetC57_1: 3V3_REG (6 pins), PWR_PROT_2 (U26_PWR_PROT_2.3 U26_PWR_PROT_2.4)
NetD13_OR_0_1: HU_revC (R137.2), OR_0 (D13_OR_0.1 R193_OR_0.1 U23_OR_0.6)
NetR52_2: HU_revC (R52.2), LAN8830_PINOUT (U29.19)
NetR53_2: HU_revC (R53.2), LAN8830_PINOUT (U29.20)
NetR54_2: HU_revC (R54.2), LAN8830_PINOUT (U29.21)
NetR55_2: HU_revC (R55.2), LAN8830_PINOUT (U29.22)
NetR56_2: HU_revC (R148.1), MCP2515_PINOUT (R56.2 U4.17)
NetR57_2: HU_revC (R146.1), MCP2515_PINOUT (R57.2 U4.11)
NetR163_2: HU_revC (R163.2), MAX_M10M_PINOUT (U14.2)
NetR164_2: HU_revC (R164.2), MAX_M10M_PINOUT (U14.3)
NetR269_1: HU_revC (R269.1), LAN8870_PINOUT (U30.16)
NetR269_2: HU_revC (R269.2), LAN8830_PINOUT (U29.25)
NetR270_2: HU_revC (R270.2), LAN8830_PINOUT (U29.26)
NetR279_1: HU_revC (R279.1), LAN8870_PINOUT (U30.25)
NetR291_1: HU_revC (R291.1), LAN8870_PINOUT (U30.26)
NetR292_1: HU_revC (R292.1), LAN8870_PINOUT (U30.27)
NetR293_1: HU_revC (R293.1), LAN8870_PINOUT (U30.28)
NetR294_1: HU_revC (R294.1), LAN8870_PINOUT (U30.23)
NetR295_1: HU_revC (R295.1), LAN8870_PINOUT (U30.24)
PCIE_CLK_N: RPI_CM5_PINOUT (J1.112), NVME (J2.53)
PCIE_CLK_P: RPI_CM5_PINOUT (J1.110), NVME (J2.55)
PCIE_RX_N: RPI_CM5_PINOUT (J1.118), NVME (J2.43)
PCIE_RX_P: RPI_CM5_PINOUT (J1.116), NVME (J2.41)
PCIE_TX_N: RPI_CM5_PINOUT (J1.124), NVME (C35.1)
PCIE_TX_P: RPI_CM5_PINOUT (J1.122), NVME (C34.1)
PRE_RC_DBG_USB_N: HU_revC (R166.2), RPI_CM5_PINOUT (J1.103)
PRE_RC_DBG_USB_P: HU_revC (R165.2), RPI_CM5_PINOUT (J1.105)
SD_CLK: RPI_CM5_PINOUT (J1.57), SD (SD1.5)
SD_CMD: RPI_CM5_PINOUT (J1.62), SD (SD1.3)
SD_DAT0: RPI_CM5_PINOUT (J1.63), SD (SD1.7)
SD_DAT1: RPI_CM5_PINOUT (J1.67), SD (SD1.8)
SD_DAT2: RPI_CM5_PINOUT (J1.69), SD (SD1.1)
SD_DAT3: RPI_CM5_PINOUT (J1.61), SD (SD1.2)
SUB_P: HU_revC (J3.28), CM6206_PINOUT (C5.2 R18.2)
TRX_CON_N: HU_revC (D24.2 D24.9 J15.1), LAN8870_PINOUT (C220.2 R261.2)
TRX_CON_P: HU_revC (D24.4 D24.7 J15.2), LAN8870_PINOUT (C219.2 R262.2)
TUSB4041_USB2_DN0_N: HU_revC (D31.2 D31.9 J7.2), TUSB4041_PINOUT (R216.1)
TUSB4041_USB2_DN0_P: HU_revC (D31.4 D31.7 J7.3), TUSB4041_PINOUT (R215.1)
TUSB4041_USB2_DN1_N: HU_revC (D30.2 D30.9 J5.2), TUSB4041_PINOUT (R221.1)
TUSB4041_USB2_DN1_P: HU_revC (D30.4 D30.7 J5.3), TUSB4041_PINOUT (R220.1)
TUSB4041_USB2_DN2_N: CM6206_PINOUT (R3.2), TUSB4041_PINOUT (R223.1)
TUSB4041_USB2_DN2_P: CM6206_PINOUT (R1.2 R2.2), TUSB4041_PINOUT (R222.1)
USB3_1_D_N: RPI_CM5_PINOUT (J1.165), TUSB4041_PINOUT (R219.1)
USB3_1_D_P: RPI_CM5_PINOUT (J1.163), TUSB4041_PINOUT (R217.1)